# Altium project bga_fast.PrjPcb (part 1 of 2)
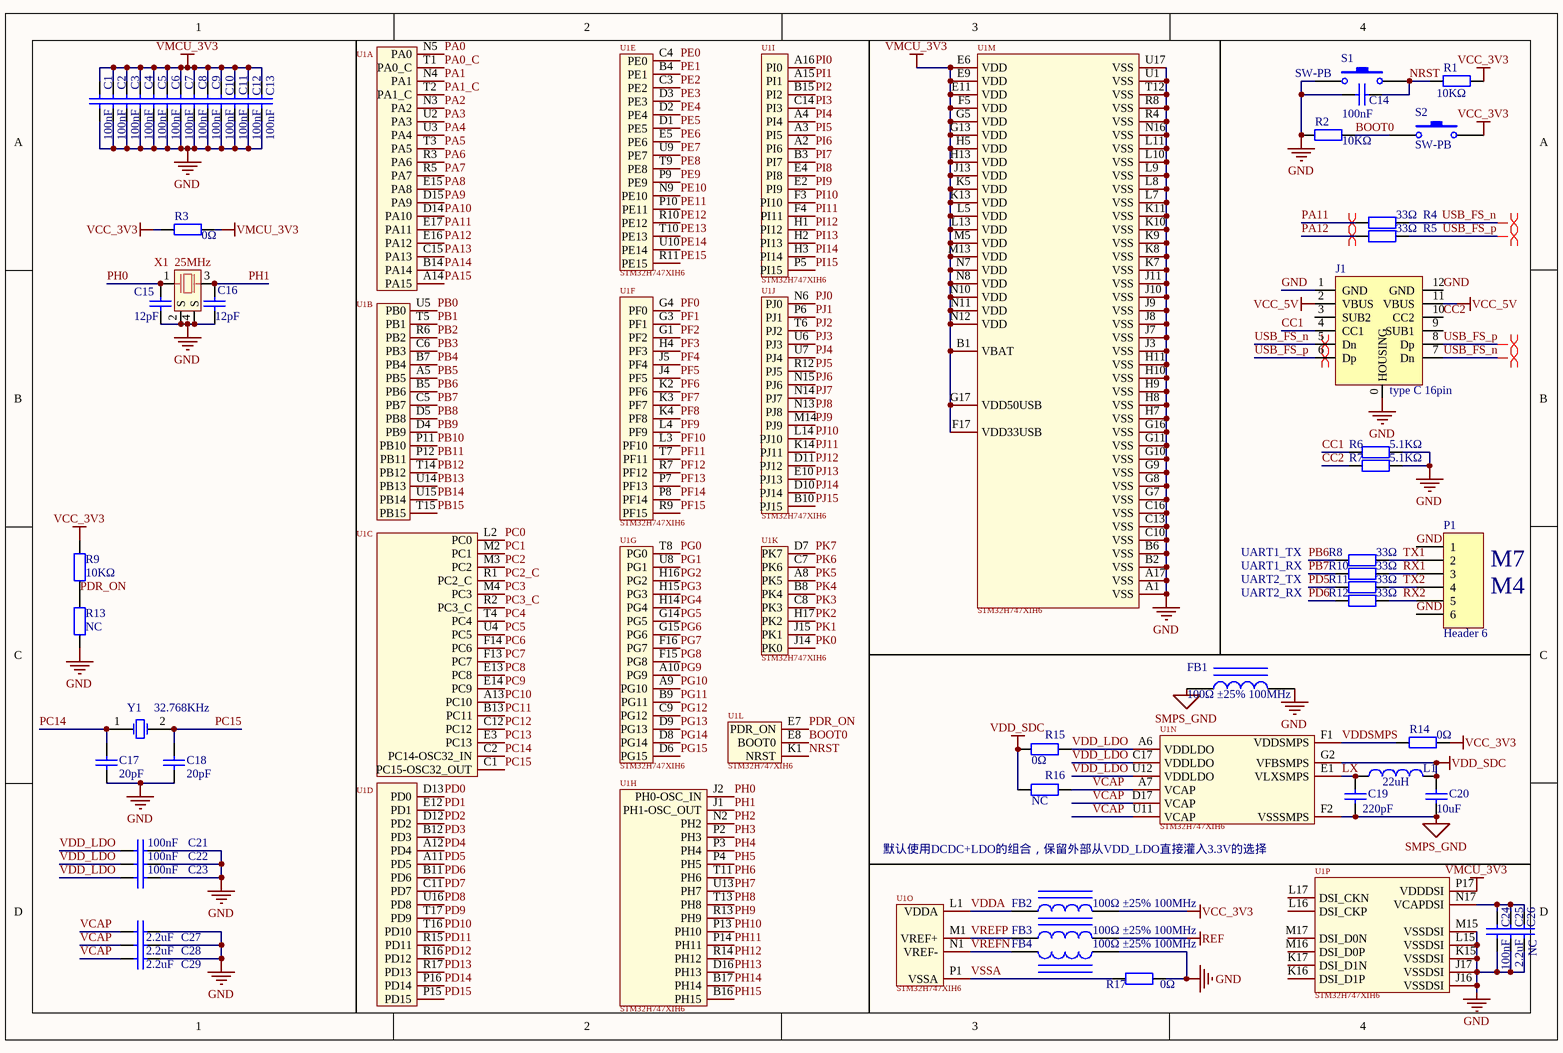
[diagram p0: mcu.SchDoc]
5 sheets, 288 parts. Net scope: global (net labels, ports and power ports of the same name join across sheets).
Board file: BGA_faser.PcbDoc
Sheets:
  mcu.SchDoc
  zynq.SchDoc
  jtag.SchDoc
  power.SchDoc
  debug.SchDoc

## Sheet mcu.SchDoc
size A4; SheetNumber: 1; SheetTotal: 4

### Parts
(Parts that share a designator on the sheet are numbered #1, #2 ... from top to bottom, then left to right.)
C1  100nF  [0201]
C2  100nF  [0201]
C3  100nF  [0201]
C4  100nF  [0201]
C5  100nF  [0201]
C6  100nF  [0201]
C7  100nF  [0201]
C8  100nF  [0201]
C9  100nF  [0201]
C10  100nF  [0201]
C11  100nF  [0201]
C12  100nF  [0201]
C13  100nF  [0201]
C14  100nF  [0402_C]
C15  12pF  [0402_C]
C16  12pF  [0402_C]
C17  20pF  [0402_C]
C18  20pF  [0402_C]
C19  220pF  [0402_C]
C20  10uF  [0603_C]
C21  100nF  [0402_C]
C22  100nF  [0402_C]
C23  100nF  [0402_C]
C24  100nF  [0402_C]
C25  2.2uF  [0402_C]
C26  NC  [0402_C]
C27  2.2uF  [0402_C]
C28  2.2uF  [0402_C]
C29  2.2uF  [0402_C]
FB1  100Ω ±25% 100MHz  [0805_L]
FB2  100Ω ±25% 100MHz  [0805_L]
FB3  100Ω ±25% 100MHz  [0805_L]
FB4  100Ω ±25% 100MHz  [0805_L]
J1  type C 16pin  [USB type C  16pin]
L1  value 22uH  [IND-SMD_L2.5-W2.0_YXMBL252010P]  (hidden comment: Inductor)
P1  Header 6  [HDR1X6]
R1  10KΩ  [0402_R]
R2  10KΩ  [0402_R]
R3  0Ω  [0402_R]
R4  33Ω  [0402_R]
R5  33Ω  [0402_R]
R6  5.1KΩ  [0402_R]
R7  5.1KΩ  [0402_R]
R8  33Ω  [0805_R]
R9  10KΩ  [0402_R]
R10  33Ω  [0805_R]
R11  33Ω  [0805_R]
R12  33Ω  [0805_R]
R13  NC  [0402_R]
R14  0Ω  [0402_R]
R15  0Ω  [0805_R]
R16  NC  [0805_R]
R17  0Ω  [0402_R]
S1  SW-PB  [SW-3*4-2P]
S2  SW-PB  [SW-3*4-2P]
U1#1  STM32H747XIH6  [TFBGA-265_L14.0-W14.0-P0.80-TL_STM32H743XIH6]  (value not drawn)  (parts A,B,C,D,E,F,G,H,I,J,K of 13)
U1#2  STM32H747XIH6  [TFBGA-265_L14.0-W14.0-P0.80-TL_STM32H743XIH6]  (parts L,M,N,O,P of 16)
X1  25MHz  [3225]
Y1  32.768KHz  [SMD-3215_2P FC - 135]

### Nets
GND: C1.1 C2.1 C3.1 C4.1 C5.1 C6.1 C7.1 C8.1 C9.1 C10.1 C11.1 C12.1 C13.1 C14.1 C15.2 C16.2 C17.1 C18.1 C21.2 C22.2 C23.2 C24.1 C25.1 C26.1 C27.2 C28.2 C29.2 FB1.2 FB4.2 J1.0(HOUSING) J1.1(GND) J1.12(GND) P1.1 P1.6 R2.1 R6.2 R7.2 R13.1 R17.1 S1.1 U1#2.A1(VSS) U1#2.A17(VSS) U1#2.B2(VSS) U1#2.B6(VSS) U1#2.C10(VSS) U1#2.C13(VSS) U1#2.C16(VSS) U1#2.G7(VSS) U1#2.G8(VSS) U1#2.G9(VSS) U1#2.G10(VSS) U1#2.G11(VSS) U1#2.G16(VSS) U1#2.H7(VSS) U1#2.H8(VSS) U1#2.H9(VSS) U1#2.H10(VSS) U1#2.H11(VSS) U1#2.J3(VSS) U1#2.J7(VSS) U1#2.J8(VSS) U1#2.J9(VSS) U1#2.J10(VSS) U1#2.J11(VSS) U1#2.J16(VSSDSI) U1#2.J17(VSSDSI) U1#2.K7(VSS) U1#2.K8(VSS) U1#2.K9(VSS) U1#2.K10(VSS) U1#2.K11(VSS) U1#2.K15(VSSDSI) U1#2.L7(VSS) U1#2.L8(VSS) U1#2.L9(VSS) U1#2.L10(VSS) U1#2.L11(VSS) U1#2.L15(VSSDSI) U1#2.M15(VSSDSI) U1#2.N16(VSS) U1#2.R4(VSS) U1#2.R8(VSS) U1#2.T12(VSS) U1#2.U1(VSS) U1#2.U17(VSS) X1.2(S) X1.4(S)
REF: FB3.2
SMPS_GND: C19.1 C20.1 FB1.1 U1#2.F2(VSSSMPS)
VCC_3V3: FB2.2 R1.2 R3.1 R9.2 R14.1 S2.2
VCC_5V: J1.2(VBUS) J1.11(VBUS)
VDD_SDC: C20.2 L1.2 R15.2 R16.2 U1#2.G2(VFBSMPS)
VMCU_3V3: C1.2 C2.2 C3.2 C4.2 C5.2 C6.2 C7.2 C8.2 C9.2 C10.2 C11.2 C12.2 C13.2 R3.2 U1#2.B1(VBAT) U1#2.E6(VDD) U1#2.E9(VDD) U1#2.E11(VDD) U1#2.F5(VDD) U1#2.F17(VDD33USB) U1#2.G5(VDD) U1#2.G13(VDD) U1#2.G17(VDD50USB) U1#2.H5(VDD) U1#2.H13(VDD) U1#2.J13(VDD) U1#2.K5(VDD) U1#2.K13(VDD) U1#2.L5(VDD) U1#2.L13(VDD) U1#2.M5(VDD) U1#2.M13(VDD) U1#2.N7(VDD) U1#2.N8(VDD) U1#2.N10(VDD) U1#2.N11(VDD) U1#2.N12(VDD) U1#2.P17(VDDDSI)
BOOT0: R2.2 S2.1 U1#2.E8(BOOT0)
CC1: J1.4(CC1) R6.1
CC2: J1.10(CC2) R7.1
LX: C19.2 L1.1 U1#2.E1(VLXSMPS)
NRST: C14.2 R1.1 S1.2 U1#2.K1(NRST)
PA0: U1#1.N5(PA0)
PA0_C: U1#1.T1(PA0_C)
PA1: U1#1.N4(PA1)
PA1_C: U1#1.T2(PA1_C)
PA2: U1#1.N3(PA2)
PA3: U1#1.U2(PA3)
PA4: U1#1.U3(PA4)
PA5: U1#1.T3(PA5)
PA6: U1#1.R3(PA6)
PA7: U1#1.R5(PA7)
PA8: U1#1.E15(PA8)
PA9: U1#1.D15(PA9)
PA10: U1#1.D14(PA10)
PA11: R4.1 U1#1.E17(PA11)
PA12: R5.1 U1#1.E16(PA12)
PA13: U1#1.C15(PA13)
PA14: U1#1.B14(PA14)
PA15: U1#1.A14(PA15)
PB0: U1#1.U5(PB0)
PB1: U1#1.T5(PB1)
PB2: U1#1.R6(PB2)
PB3: U1#1.C6(PB3)
PB4: U1#1.B7(PB4)
PB5: U1#1.A5(PB5)
PB6: R8.1 U1#1.B5(PB6)
PB7: R10.1 U1#1.C5(PB7)
PB8: U1#1.D5(PB8)
PB9: U1#1.D4(PB9)
PB10: U1#1.P11(PB10)
PB11: U1#1.P12(PB11)
PB12: U1#1.T14(PB12)
PB13: U1#1.U14(PB13)
PB14: U1#1.U15(PB14)
PB15: U1#1.T15(PB15)
PC0: U1#1.L2(PC0)
PC1: U1#1.M2(PC1)
PC2: U1#1.M3(PC2)
PC2_C: U1#1.R1(PC2_C)
PC3: U1#1.M4(PC3)
PC3_C: U1#1.R2(PC3_C)
PC4: U1#1.T4(PC4)
PC5: U1#1.U4(PC5)
PC6: U1#1.F14(PC6)
PC7: U1#1.F13(PC7)
PC8: U1#1.E13(PC8)
PC9: U1#1.E14(PC9)
PC10: U1#1.A13(PC10)
PC11: U1#1.B13(PC11)
PC12: U1#1.C12(PC12)
PC13: U1#1.E3(PC13)
PC14: C17.2 U1#1.C2(PC14-OSC32_IN) Y1.1(OSC1)
PC15: C18.2 U1#1.C1(PC15-OSC32_OUT) Y1.2(OSC2)
PD0: U1#1.D13(PD0)
PD1: U1#1.E12(PD1)
PD2: U1#1.D12(PD2)
PD3: U1#1.B12(PD3)
PD4: U1#1.A12(PD4)
PD5: R11.1 U1#1.A11(PD5)
PD6: R12.1 U1#1.B11(PD6)
PD7: U1#1.C11(PD7)
PD8: U1#1.U16(PD8)
PD9: U1#1.T17(PD9)
PD10: U1#1.T16(PD10)
PD11: U1#1.R15(PD11)
PD12: U1#1.R16(PD12)
PD13: U1#1.R17(PD13)
PD14: U1#1.P16(PD14)
PD15: U1#1.P15(PD15)
PDR_ON: R9.1 R13.2 U1#2.E7(PDR_ON)
PE0: U1#1.C4(PE0)
PE1: U1#1.B4(PE1)
PE2: U1#1.C3(PE2)
PE3: U1#1.D3(PE3)
PE4: U1#1.D2(PE4)
PE5: U1#1.D1(PE5)
PE6: U1#1.E5(PE6)
PE7: U1#1.U9(PE7)
PE8: U1#1.T9(PE8)
PE9: U1#1.P9(PE9)
PE10: U1#1.N9(PE10)
PE11: U1#1.P10(PE11)
PE12: U1#1.R10(PE12)
PE13: U1#1.T10(PE13)
PE14: U1#1.U10(PE14)
PE15: U1#1.R11(PE15)
PF0: U1#1.G4(PF0)
PF1: U1#1.G3(PF1)
PF2: U1#1.G1(PF2)
PF3: U1#1.H4(PF3)
PF4: U1#1.J5(PF4)
PF5: U1#1.J4(PF5)
PF6: U1#1.K2(PF6)
PF7: U1#1.K3(PF7)
PF8: U1#1.K4(PF8)
PF9: U1#1.L4(PF9)
PF10: U1#1.L3(PF10)
PF11: U1#1.T7(PF11)
PF12: U1#1.R7(PF12)
PF13: U1#1.P7(PF13)
PF14: U1#1.P8(PF14)
PF15: U1#1.R9(PF15)
PG0: U1#1.T8(PG0)
PG1: U1#1.U8(PG1)
PG2: U1#1.H16(PG2)
PG3: U1#1.H15(PG3)
PG4: U1#1.H14(PG4)
PG5: U1#1.G14(PG5)
PG6: U1#1.G15(PG6)
PG7: U1#1.F16(PG7)
PG8: U1#1.F15(PG8)
PG9: U1#1.A10(PG9)
PG10: U1#1.A9(PG10)
PG11: U1#1.B9(PG11)
PG12: U1#1.C9(PG12)
PG13: U1#1.D9(PG13)
PG14: U1#1.D8(PG14)
PG15: U1#1.D6(PG15)
PH0: C15.1 U1#1.J2(PH0-OSC_IN) X1.1
PH1: C16.1 U1#1.J1(PH1-OSC_OUT) X1.3
PH2: U1#1.N2(PH2)
PH3: U1#1.P2(PH3)
PH4: U1#1.P3(PH4)
PH5: U1#1.P4(PH5)
PH6: U1#1.T11(PH6)
PH7: U1#1.U13(PH7)
PH8: U1#1.T13(PH8)
PH9: U1#1.R13(PH9)
PH10: U1#1.P13(PH10)
PH11: U1#1.P14(PH11)
PH12: U1#1.R14(PH12)
PH13: U1#1.D16(PH13)
PH14: U1#1.B17(PH14)
PH15: U1#1.B16(PH15)
PI0: U1#1.A16(PI0)
PI1: U1#1.A15(PI1)
PI2: U1#1.B15(PI2)
PI3: U1#1.C14(PI3)
PI4: U1#1.A4(PI4)
PI5: U1#1.A3(PI5)
PI6: U1#1.A2(PI6)
PI7: U1#1.B3(PI7)
PI8: U1#1.E4(PI8)
PI9: U1#1.E2(PI9)
PI10: U1#1.F3(PI10)
PI11: U1#1.F4(PI11)
PI12: U1#1.H1(PI12)
PI13: U1#1.H2(PI13)
PI14: U1#1.H3(PI14)
PI15: U1#1.P5(PI15)
PJ0: U1#1.N6(PJ0)
PJ1: U1#1.P6(PJ1)
PJ2: U1#1.T6(PJ2)
PJ3: U1#1.U6(PJ3)
PJ4: U1#1.U7(PJ4)
PJ5: U1#1.R12(PJ5)
PJ6: U1#1.N15(PJ6)
PJ7: U1#1.N14(PJ7)
PJ8: U1#1.N13(PJ8)
PJ9: U1#1.M14(PJ9)
PJ10: U1#1.L14(PJ10)
PJ11: U1#1.K14(PJ11)
PJ12: U1#1.D11(PJ12)
PJ13: U1#1.E10(PJ13)
PJ14: U1#1.D10(PJ14)
PJ15: U1#1.B10(PJ15)
PK0: U1#1.J14(PK0)
PK1: U1#1.J15(PK1)
PK2: U1#1.H17(PK2)
PK3: U1#1.C8(PK3)
PK4: U1#1.B8(PK4)
PK5: U1#1.A8(PK5)
PK6: U1#1.C7(PK6)
PK7: U1#1.D7(PK7)
RX1: P1.3 R10.2
RX2: P1.5 R12.2
TX1: P1.2 R8.2
TX2: P1.4 R11.2
USB_FS_n: J1.5(Dn) J1.7(Dn) R4.2
USB_FS_p: J1.6(Dp) J1.8(Dp) R5.2
VCAP: C27.1 C28.1 C29.1 R16.1 U1#2.A7(VCAP) U1#2.D17(VCAP) U1#2.U11(VCAP)
VDD_LDO: C21.1 C22.1 C23.1 R15.1 U1#2.A6(VDDLDO) U1#2.C17(VDDLDO) U1#2.U12(VDDLDO)
VDDA: FB2.1 U1#2.L1(VDDA)
VDDSMPS: R14.2 U1#2.F1(VDDSMPS)
VREFN: FB4.1 U1#2.N1(VREF-)
VREFP: FB3.1 U1#2.M1(VREF+)
VSSA: R17.2 U1#2.P1(VSSA)
NetC24_2: C24.2 C25.2 C26.2 U1#2.N17(VCAPDSI)

Not connected (* = marked no-connect by the designer): J1 3(SUB2) 9(SUB1); U1#2 K16(DSI_D1P) K17(DSI_D1N) L16(DSI_CKP) L17(DSI_CKN) M16(DSI_D0P) M17(DSI_D0N)

### Layout directives
differential pair: PA11, PA12, USB_FS_n, USB_FS_p

### Notes on the sheet
- UART1_TX
- UART1_RX
- UART2_TX
- (near P1) M7
- UART2_RX
- (near P1) M4
- (near U1#2) 默认使用DCDC+LDO的组合，保留外部从VDD_LDO直接灌入3.3V的选择

### Library data of the parts
C1-C14 C21-C24 = 0402 100nF (104) 10% 16V: 贴片电容; ComponentLink1Description: 供应商链接; ComponentLink1URL: http://www.szlcsc.com/product/details_1877.html; Package: 0402; Supplier: LC; SuppliersPartNumber: C1525
C15-C18 = 0402 20pF (200) 5% 50V: 贴片电容; ComponentLink1Description: 供应商链接; ComponentLink1URL: http://www.szlcsc.com/product/details_1906.html; Package: 0402; Supplier: LC; SuppliersPartNumber: C1554
C19 = 0402 220pF (221) 10% 50V: 贴片电容; ComponentLink1Description: 供应商链接; ComponentLink1URL: http://www.szlcsc.com/product/details_1882.html; Package: 0402; Supplier: LC; SuppliersPartNumber: C1530
C20 = 0603 10uF (106) 10% 10V: 贴片电容; ComponentLink1Description: 供应商链接; ComponentLink1URL: http://www.szlcsc.com/product/details_20411.html; Package: 0603; Supplier: LC; SuppliersPartNumber: C19702
C25 C26 = 0402 2.2nF (222) 10% 50V: 贴片电容; ComponentLink1Description: 供应商链接; ComponentLink1URL: http://www.szlcsc.com/product/details_1883.html; Package: 0402; Supplier: LC; SuppliersPartNumber: C1531
C27-C29 = 0402 1.0uF (105) 10% 25V: 贴片电容; ComponentLink1Description: 供应商链接; ComponentLink1URL: http://www.szlcsc.com/product/details_53938.html; Package: 0402; Supplier: LC; SuppliersPartNumber: C52923
FB1-FB4 = 0805 100Ω 25% 100MHz: 贴片磁珠; ComponentLink1Description: 供应商链接; ComponentLink1URL: http://www.szlcsc.com/product/details_1367.html; Package: 0805; Supplier: LC; SuppliersPartNumber: C1015
J1 = USB type C 16pin: 16针脚C口
L1 = Inductor: Code_IEC: 1005; Published: 8-Jun-2000; LatestRevisionDate: 29-May-2009; LatestRevisionNote: IPC-7351 Footprint Added.; PackageReference: 0402-A; Publisher: Altium Limited; PackageDescription: Chip Inductor; Code_JEITA: 0402
P1 = Header 6: Header, 6-Pin; LatestRevisionDate: 17-Jul-2002; LatestRevisionNote: Re-released for DXP Platform.; Publisher: Altium Limited
R1 R2 R9 R13 = 0402 10KΩ (1002) 1%: 贴片电阻; ComponentLink1Description: 供应商链接; ComponentLink1URL: http://www.szlcsc.com/product/details_26487.html; Package: 0402; Supplier: LC; SuppliersPartNumber: C25744
R3 R14-R17 = 0402 0Ω (0R0) 1%: 贴片电阻; ComponentLink1Description: 供应商链接; ComponentLink1URL: http://www.szlcsc.com/product/details_17853.html; Package: 0402; Supplier: LC; SuppliersPartNumber: C17168
R4 R5 R8 R10-R12 = 0402 33Ω (33R0) 1%: 贴片电阻; ComponentLink1Description: 供应商链接; ComponentLink1URL: http://www.szlcsc.com/product/details_25848.html; Package: 0402; Supplier: LC; SuppliersPartNumber: C25105
R6 R7 = 0402 5.1KΩ (5101) 1%: 贴片电阻; ComponentLink1Description: 供应商链接; ComponentLink1URL: http://www.szlcsc.com/product/details_26648.html; Package: 0402; Supplier: LC; SuppliersPartNumber: C25905
S1 S2 = SW-PB: Switch; Published: 24-Mar-1999; LatestRevisionDate: 17-Jul-2002; LatestRevisionNote: Re-released for DXP Platform.; PackageReference: SPST-2; Publisher: Altium Limited; PackageDescription: Switch; 2 Leads
U1#1 U1#2 = STM32H747XIH6: 双核MCU; Manufacturer: ST(意法半导体); Add into BOM: yes; Symbol: STM32H747XIH6; Device: STM32H747XIH6; LCSC Part Name: 带DSP和DP-FPU的高性能ARM Cortex-M7 + Cortex-M4 MCU，具有2 MB Flash、1 MB RAM、480 MHz CPU、ART加速器、一级缓存、外部存储器接口、大量外设、SMPS和MIPI-DSI; Supplier Part: C5271089; Manufacturer Part: STM32H747XIH6; Supplier Footprint: TFBGA-265(14x14); JLCPCB Part Class: Extended Part; Datasheet: https://atta.szlcsc.com/upload/public/pdf/source/20230906/B22899485390F262A37AA3B845B2D1AE.pdf; Supplier: LCSC; Convert to PCB: yes
X1 = 四脚无源晶体: 4脚贴片无源晶体; Manufacturer: YJX(雅晶鑫); Symbol: TAXM8M4RDBCCT2T; Add into BOM: yes; Value: 8MHz; Normal temperature Frequency Tolerance: ±10ppm; Load Capacitance: 10pF; Frequency Stability: ±15ppm; Equivalent Series Resistance(ESR): 250Ω; Device: TAXM8M4RDBCCT2T; LCSC Part Name: 8MHz ±10ppm 10pF; Supplier Part: C400090; Manufacturer Part: TAXM8M4RDBCCT2T; Supplier Footprint: SMD3225-4P; JLCPCB Part Class: Extended Part; Datasheet: https://atta.szlcsc.com/upload/public/pdf/source/20190626/C400090_CF95B89E745AFE4EF2E392EF8AC009D6.pdf; Supplier: LCSC; Convert to PCB: yes; Type: 贴片晶振; Operating Temperature: -40℃~+85℃
Y1 = SMD-3215_2P 32.768KHz 20ppm 12.5pF: 贴片晶振; ComponentLink1Description: 供应商链接; ComponentLink1URL: http://www.szlcsc.com/product/details_33310.html; Package: SMD-3215_2P; Supplier: LC; SuppliersPartNumber: C32346

## Sheet zynq.SchDoc
size A3; SheetNumber: 2; SheetTotal: 5
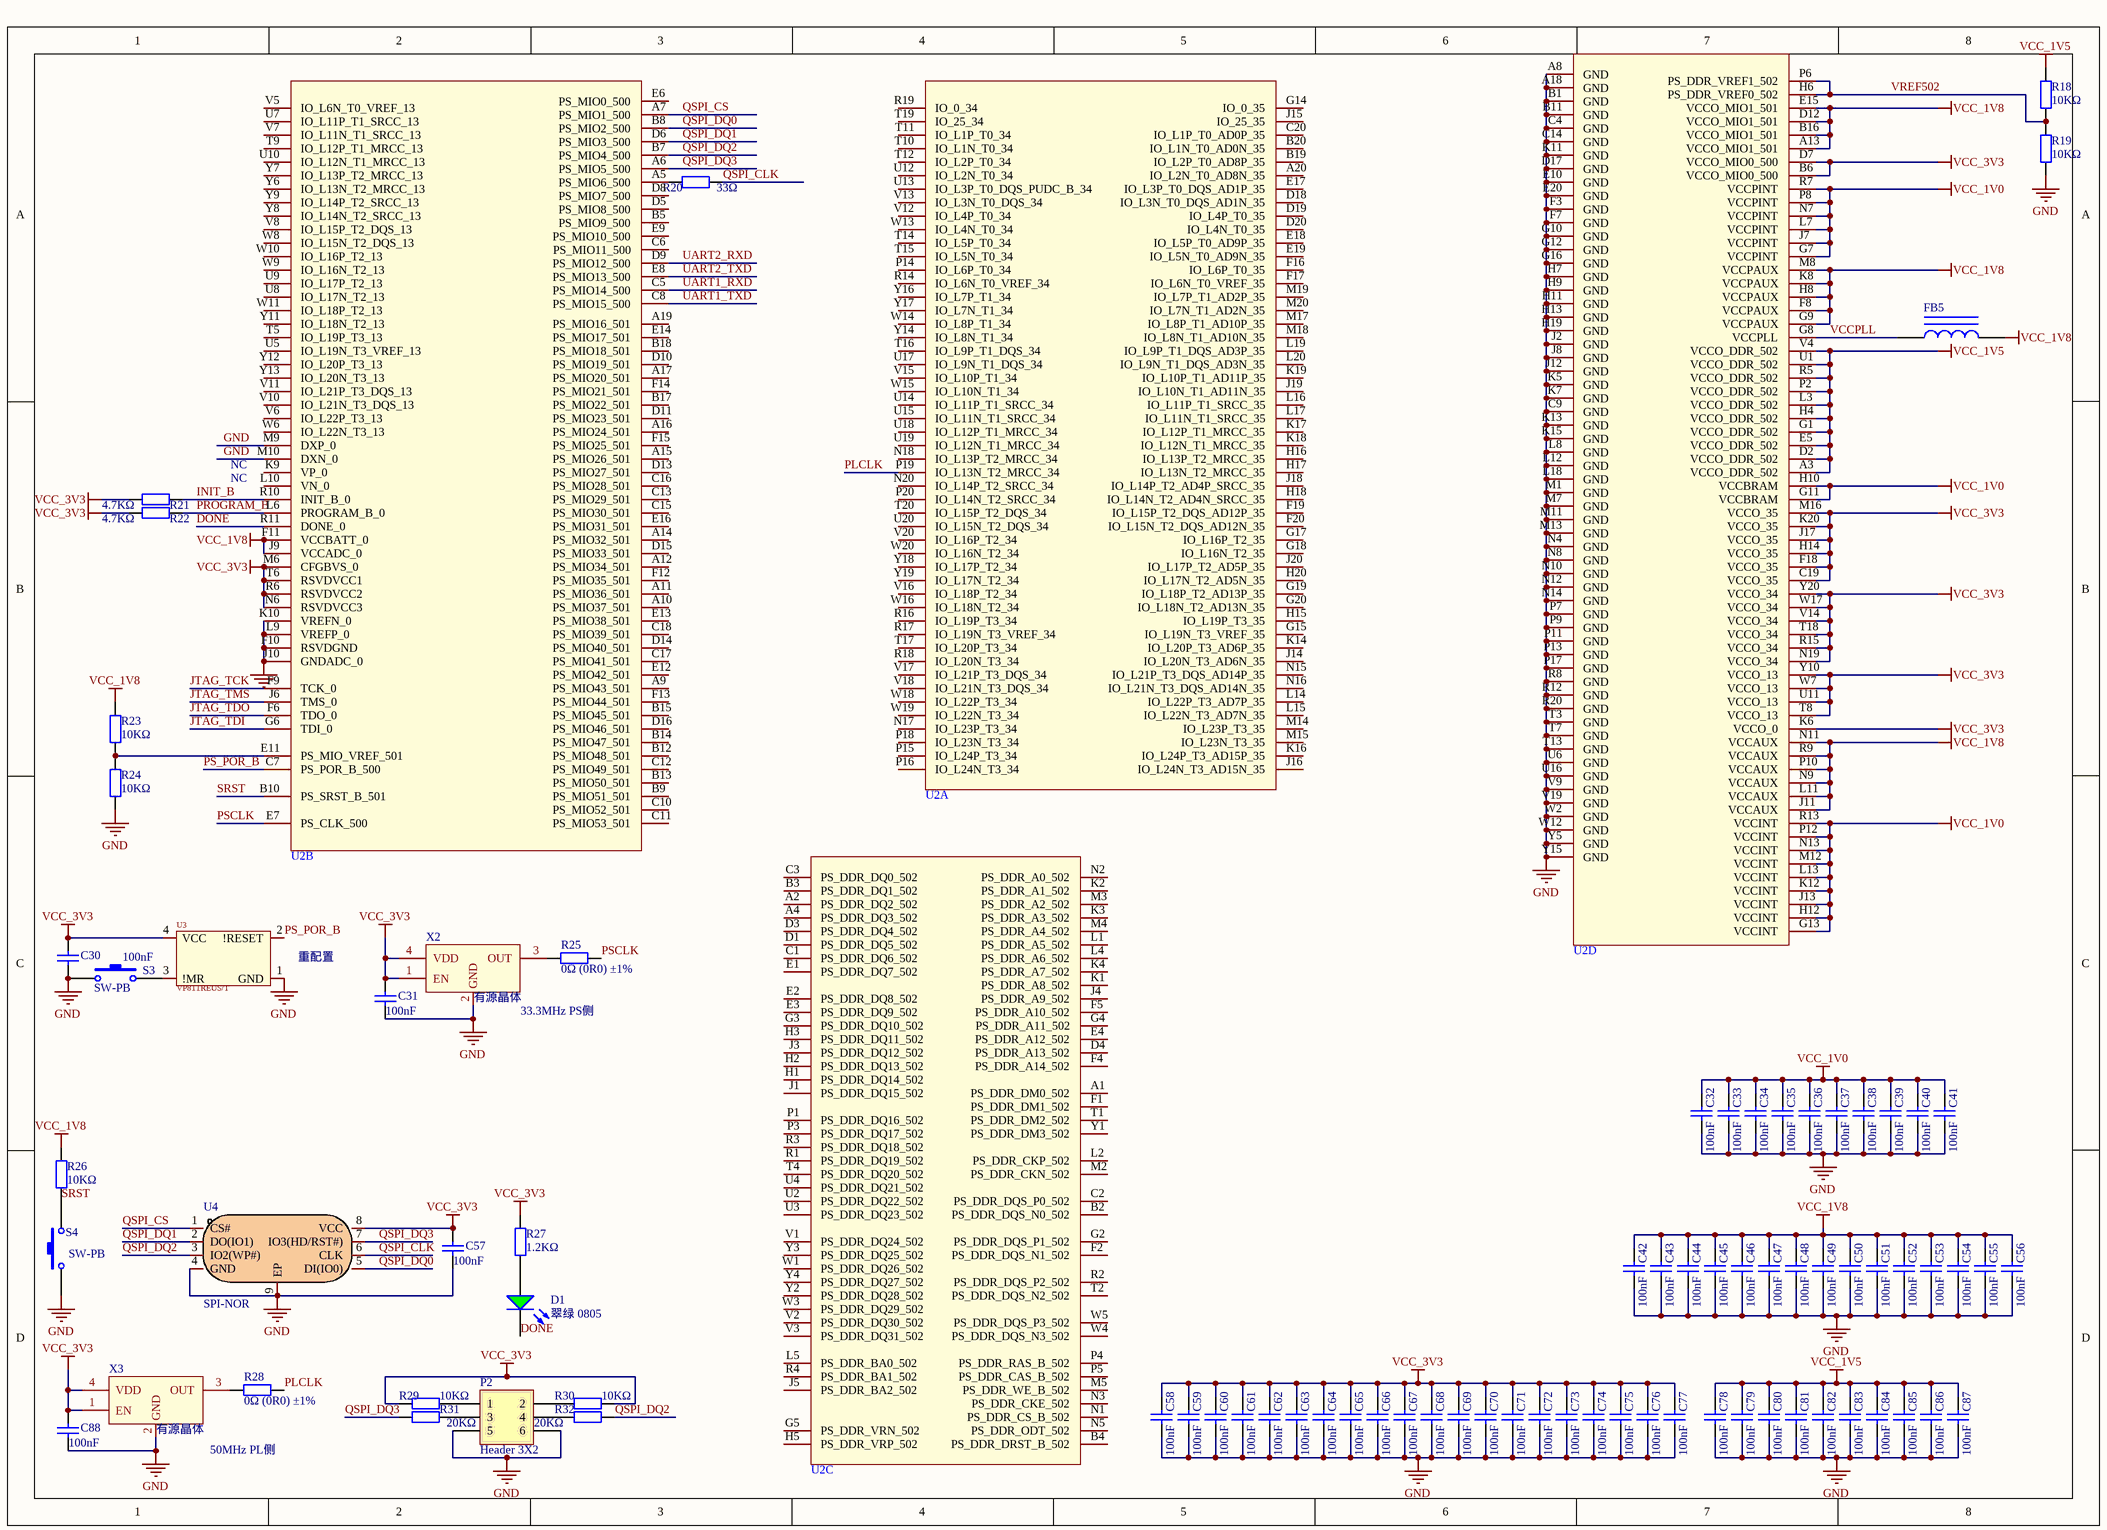
[diagram p1: zynq.SchDoc]

### Parts
C30  100nF  [0805_C]
C31  100nF  [0805_C]
C32  100nF  [0201]
C33  100nF  [0201]
C34  100nF  [0201]
C35  100nF  [0201]
C36  100nF  [0201]
C37  100nF  [0201]
C38  100nF  [0201]
C39  100nF  [0201]
C40  100nF  [0201]
C41  100nF  [0201]
C42  100nF  [0201]
C43  100nF  [0201]
C44  100nF  [0201]
C45  100nF  [0201]
C46  100nF  [0201]
C47  100nF  [0201]
C48  100nF  [0201]
C49  100nF  [0201]
C50  100nF  [0201]
C51  100nF  [0201]
C52  100nF  [0201]
C53  100nF  [0201]
C54  100nF  [0201]
C55  100nF  [0201]
C56  100nF  [0201]
C57  100nF  [0402_C]
C58  100nF  [0201]
C59  100nF  [0201]
C60  100nF  [0201]
C61  100nF  [0201]
C62  100nF  [0201]
C63  100nF  [0201]
C64  100nF  [0201]
C65  100nF  [0201]
C66  100nF  [0201]
C67  100nF  [0201]
C68  100nF  [0201]
C69  100nF  [0201]
C70  100nF  [0201]
C71  100nF  [0201]
C72  100nF  [0201]
C73  100nF  [0201]
C74  100nF  [0201]
C75  100nF  [0201]
C76  100nF  [0201]
C77  100nF  [0201]
C78  100nF  [0201]
C79  100nF  [0201]
C80  100nF  [0201]
C81  100nF  [0201]
C82  100nF  [0201]
C83  100nF  [0201]
C84  100nF  [0201]
C85  100nF  [0201]
C86  100nF  [0201]
C87  100nF  [0201]
C88  100nF  [0805_C]
D1  翠绿 0805  [0805_LED_S1]
FB5  100Ω ±25% 100MHz  [0805_L]  (value not drawn)
P2  Header 3X2  [HDR2X3]
R18  10KΩ  [0805_R]
R19  10KΩ  [0805_R]
R20  33Ω  [0402_R]
R21  4.7KΩ  [0805_R]
R22  4.7KΩ  [0805_R]
R23  10KΩ  [0805_R]
R24  10KΩ  [0805_R]
R25  0Ω (0R0) ±1%  [0805_R]
R26  10KΩ  [0805_R]
R27  1.2KΩ  [0805_R]
R28  0Ω (0R0) ±1%  [0805_R]
R29  10KΩ  [0402_R]
R30  10KΩ  [0402_R]
R31  20KΩ  [0402_R]
R32  20KΩ  [0402_R]
S3  SW-PB  [SW-3*4-2P]
S4  SW-PB  [SW-3*4-2P]
U2  XC7Z020-2CLG400I  [FBGA-400_L17.0-W17.0-R20-C20-P0.80-TL]  (value not drawn)  (parts A,B,C,D of 4)
U3  VP811REUS/T  [SOT-143_L2.9-W1.3-P1.92-LS2.3-BL]
U4  SPI-NOR  [WSON8]
X2  有源晶体  [3225]
X3  有源晶体  [3225]

### Nets
GND: C30.1 C31.1 C32.1 C33.1 C34.1 C35.1 C36.1 C37.1 C38.1 C39.1 C40.1 C41.1 C42.1 C43.1 C44.1 C45.1 C46.1 C47.1 C48.1 C49.1 C50.1 C51.1 C52.1 C53.1 C54.1 C55.1 C56.1 C57.1 C58.1 C59.1 C60.1 C61.1 C62.1 C63.1 C64.1 C65.1 C66.1 C67.1 C68.1 C69.1 C70.1 C71.1 C72.1 C73.1 C74.1 C75.1 C76.1 C77.1 C78.1 C79.1 C80.1 C81.1 C82.1 C83.1 C84.1 C85.1 C86.1 C87.1 C88.1 P2.5 P2.6 R19.1 R24.1 S3.1 S4.1 U2.A8(GND) U2.A18(GND) U2.B1(GND) U2.B11(GND) U2.C4(GND) U2.C9(GND) U2.C14(GND) U2.D17(GND) U2.E10(GND) U2.E20(GND) U2.F3(GND) U2.F7(GND) U2.F10(RSVDGND) U2.G10(GND) U2.G12(GND) U2.G16(GND) U2.H7(GND) U2.H9(GND) U2.H11(GND) U2.H13(GND) U2.H19(GND) U2.J2(GND) U2.J8(GND) U2.J10(GNDADC_0) U2.J12(GND) U2.K5(GND) U2.K7(GND) U2.K10(VREFN_0) U2.K11(GND) U2.K13(GND) U2.K15(GND) U2.L8(GND) U2.L9(VREFP_0) U2.L12(GND) U2.L18(GND) U2.M1(GND) U2.M7(GND) U2.M9(DXP_0) U2.M10(DXN_0) U2.M11(GND) U2.M13(GND) U2.N4(GND) U2.N8(GND) U2.N10(GND) U2.N12(GND) U2.N14(GND) U2.P7(GND) U2.P9(GND) U2.P11(GND) U2.P13(GND) U2.P17(GND) U2.R8(GND) U2.R12(GND) U2.R20(GND) U2.T3(GND) U2.T7(GND) U2.T13(GND) U2.U6(GND) U2.U16(GND) U2.V9(GND) U2.V19(GND) U2.W2(GND) U2.W12(GND) U2.Y5(GND) U2.Y15(GND) U3.1(GND) U4.4(GND) U4.9(EP) X2.2(GND) X3.2(GND)
VCC_1V0: C32.2 C33.2 C34.2 C35.2 C36.2 C37.2 C38.2 C39.2 C40.2 C41.2 U2.G7(VCCPINT) U2.G11(VCCBRAM) U2.G13(VCCINT) U2.H10(VCCBRAM) U2.H12(VCCINT) U2.J7(VCCPINT) U2.J13(VCCINT) U2.K12(VCCINT) U2.L7(VCCPINT) U2.L13(VCCINT) U2.M12(VCCINT) U2.N7(VCCPINT) U2.N13(VCCINT) U2.P8(VCCPINT) U2.P12(VCCINT) U2.R7(VCCPINT) U2.R13(VCCINT)
VCC_1V5: C78.2 C79.2 C80.2 C81.2 C82.2 C83.2 C84.2 C85.2 C86.2 C87.2 R18.2 U2.A3(VCCO_DDR_502) U2.D2(VCCO_DDR_502) U2.E5(VCCO_DDR_502) U2.G1(VCCO_DDR_502) U2.H4(VCCO_DDR_502) U2.L3(VCCO_DDR_502) U2.P2(VCCO_DDR_502) U2.R5(VCCO_DDR_502) U2.U1(VCCO_DDR_502) U2.V4(VCCO_DDR_502)
VCC_1V8: C42.2 C43.2 C44.2 C45.2 C46.2 C47.2 C48.2 C49.2 C50.2 C51.2 C52.2 C53.2 C54.2 C55.2 C56.2 FB5.2 R23.2 R26.2 U2.A13(VCCO_MIO1_501) U2.B16(VCCO_MIO1_501) U2.D12(VCCO_MIO1_501) U2.E15(VCCO_MIO1_501) U2.F8(VCCPAUX) U2.F11(VCCBATT_0) U2.G9(VCCPAUX) U2.H8(VCCPAUX) U2.J9(VCCADC_0) U2.J11(VCCAUX) U2.K8(VCCPAUX) U2.L11(VCCAUX) U2.M8(VCCPAUX) U2.N9(VCCAUX) U2.N11(VCCAUX) U2.P10(VCCAUX) U2.R9(VCCAUX)
VCC_3V3: C30.2 C31.2 C57.2 C58.2 C59.2 C60.2 C61.2 C62.2 C63.2 C64.2 C65.2 C66.2 C67.2 C68.2 C69.2 C70.2 C71.2 C72.2 C73.2 C74.2 C75.2 C76.2 C77.2 C88.2 R21.1 R22.1 R27.2 R29.1 R30.2 U2.B6(VCCO_MIO0_500) U2.C19(VCCO_35) U2.D7(VCCO_MIO0_500) U2.F18(VCCO_35) U2.H14(VCCO_35) U2.J17(VCCO_35) U2.K6(VCCO_0) U2.K20(VCCO_35) U2.M6(CFGBVS_0) U2.M16(VCCO_35) U2.N6(RSVDVCC3) U2.N19(VCCO_34) U2.R6(RSVDVCC2) U2.R15(VCCO_34) U2.T6(RSVDVCC1) U2.T8(VCCO_13) U2.T18(VCCO_34) U2.U11(VCCO_13) U2.V14(VCCO_34) U2.W7(VCCO_13) U2.W17(VCCO_34) U2.Y10(VCCO_13) U2.Y20(VCCO_34) U3.4(VCC) U4.8(VCC) X2.1(EN) X2.4(VDD) X3.1(EN) X3.4(VDD)
DONE: D1.K U2.R11(DONE_0)
INIT_B: R21.2 U2.R10(INIT_B_0)
JTAG_TCK: U2.F9(TCK_0)
JTAG_TDI: U2.G6(TDI_0)
JTAG_TDO: U2.F6(TDO_0)
JTAG_TMS: U2.J6(TMS_0)
PLCLK: R28.2 U2.P19(IO_L13N_T2_MRCC_34)
PROGRAM_B: R22.2 U2.L6(PROGRAM_B_0)
PS_POR_B: U2.C7(PS_POR_B_500) U3.2(!RESET)
PSCLK: R25.2 U2.E7(PS_CLK_500)
QSPI_CLK: R20.2 U4.6(CLK)
QSPI_CS: U2.A7(PS_MIO1_500) U4.1(CS#)
QSPI_DQ0: U2.B8(PS_MIO2_500) U4.5(DI(IO0))
QSPI_DQ1: U2.D6(PS_MIO3_500) U4.2(DO(IO1))
QSPI_DQ2: R32.2 U2.B7(PS_MIO4_500) U4.3(IO2(WP#))
QSPI_DQ3: R31.1 U2.A6(PS_MIO5_500) U4.7(IO3(HD/RST#))
SRST: R26.1 S4.2 U2.B10(PS_SRST_B_501)
UART1_RXD: U2.C5(PS_MIO14_500)
UART1_TXD: U2.C8(PS_MIO15_500)
UART2_RXD: U2.D9(PS_MIO12_500)
UART2_TXD: U2.E8(PS_MIO13_500)
VCCPLL: FB5.1 U2.G8(VCCPLL)
VREF502: R18.1 R19.2 U2.H6(PS_DDR_VREF0_502) U2.P6(PS_DDR_VREF1_502)
NetD1_A: D1.A R27.1
NetP2_1: P2.1 R29.2
NetP2_2: P2.2 R30.1
NetP2_3: P2.3 R31.2
NetP2_4: P2.4 R32.1
NetR20_1: R20.1 U2.A5(PS_MIO6_500)
NetR23_1: R23.1 R24.2 U2.E11(PS_MIO_VREF_501)
NetR25_1: R25.1 X2.3(OUT)
NetR28_1: R28.1 X3.3(OUT)
NetS3_2: S3.2 U3.3(!MR)

Not connected (* = marked no-connect by the designer): U2 A1(PS_DDR_DM0_502) A2(PS_DDR_DQ2_502) A4(PS_DDR_DQ3_502) A9(PS_MIO43_501) A10(PS_MIO37_501) A11(PS_MIO36_501) A12(PS_MIO34_501) A14(PS_MIO32_501) A15(PS_MIO26_501) A16(PS_MIO24_501) A17(PS_MIO20_501) A19(PS_MIO16_501) A20(IO_L2N_T0_AD8N_35) B2(PS_DDR_DQS_N0_502) B3(PS_DDR_DQ1_502) B4(PS_DDR_DRST_B_502) B5(PS_MIO9_500) B9(PS_MIO51_501) B12(PS_MIO48_501) B13(PS_MIO50_501) B14(PS_MIO47_501) B15(PS_MIO45_501) B17(PS_MIO22_501) B18(PS_MIO18_501) B19(IO_L2P_T0_AD8P_35) B20(IO_L1N_T0_AD0N_35) C1(PS_DDR_DQ6_502) C2(PS_DDR_DQS_P0_502) C3(PS_DDR_DQ0_502) C6(PS_MIO11_500) C10(PS_MIO52_501) C11(PS_MIO53_501) C12(PS_MIO49_501) C13(PS_MIO29_501) C15(PS_MIO30_501) C16(PS_MIO28_501) C17(PS_MIO41_501) C18(PS_MIO39_501) C20(IO_L1P_T0_AD0P_35) D1(PS_DDR_DQ5_502) D3(PS_DDR_DQ4_502) D4(PS_DDR_A13_502) D5(PS_MIO8_500) D8(PS_MIO7_500) D10(PS_MIO19_501) D11(PS_MIO23_501) D13(PS_MIO27_501) D14(PS_MIO40_501) D15(PS_MIO33_501) D16(PS_MIO46_501) D18(IO_L3N_T0_DQS_AD1N_35) D19(IO_L4P_T0_35) D20(IO_L4N_T0_35) E1(PS_DDR_DQ7_502) E2(PS_DDR_DQ8_502) E3(PS_DDR_DQ9_502) E4(PS_DDR_A12_502) E6(PS_MIO0_500) E9(PS_MIO10_500) E12(PS_MIO42_501) E13(PS_MIO38_501) E14(PS_MIO17_501) E16(PS_MIO31_501) E17(IO_L3P_T0_DQS_AD1P_35) E18(IO_L5P_T0_AD9P_35) E19(IO_L5N_T0_AD9N_35) F1(PS_DDR_DM1_502) F2(PS_DDR_DQS_N1_502) F4(PS_DDR_A14_502) F5(PS_DDR_A10_502) F12(PS_MIO35_501) F13(PS_MIO44_501) F14(PS_MIO21_501) F15(PS_MIO25_501) F16(IO_L6P_T0_35) F17(IO_L6N_T0_VREF_35) F19(IO_L15P_T2_DQS_AD12P_35) F20(IO_L15N_T2_DQS_AD12N_35) G2(PS_DDR_DQS_P1_502) G3(PS_DDR_DQ10_502) G4(PS_DDR_A11_502) G5(PS_DDR_VRN_502) G14(IO_0_35) G15(IO_L19N_T3_VREF_35) G17(IO_L16P_T2_35) G18(IO_L16N_T2_35) G19(IO_L18P_T2_AD13P_35) G20(IO_L18N_T2_AD13N_35) H1(PS_DDR_DQ14_502) H2(PS_DDR_DQ13_502) H3(PS_DDR_DQ11_502) H5(PS_DDR_VRP_502) H15(IO_L19P_T3_35) H16(IO_L13P_T2_MRCC_35) H17(IO_L13N_T2_MRCC_35) H18(IO_L14N_T2_AD4N_SRCC_35) H20(IO_L17N_T2_AD5N_35) J1(PS_DDR_DQ15_502) J3(PS_DDR_DQ12_502) J4(PS_DDR_A9_502) J5(PS_DDR_BA2_502) J14(IO_L20N_T3_AD6N_35) J15(IO_25_35) J16(IO_L24N_T3_AD15N_35) J18(IO_L14P_T2_AD4P_SRCC_35) J19(IO_L10N_T1_AD11N_35) J20(IO_L17P_T2_AD5P_35) K1(PS_DDR_A8_502) K2(PS_DDR_A1_502) K3(PS_DDR_A3_502) K4(PS_DDR_A7_502) K9(VP_0) K14(IO_L20P_T3_AD6P_35) K16(IO_L24P_T3_AD15P_35) K17(IO_L12P_T1_MRCC_35) K18(IO_L12N_T1_MRCC_35) K19(IO_L10P_T1_AD11P_35) L1(PS_DDR_A5_502) L2(PS_DDR_CKP_502) L4(PS_DDR_A6_502) L5(PS_DDR_BA0_502) L10(VN_0) L14(IO_L22P_T3_AD7P_35) L15(IO_L22N_T3_AD7N_35) L16(IO_L11P_T1_SRCC_35) L17(IO_L11N_T1_SRCC_35) L19(IO_L9P_T1_DQS_AD3P_35) L20(IO_L9N_T1_DQS_AD3N_35) M2(PS_DDR_CKN_502) M3(PS_DDR_A2_502) M4(PS_DDR_A4_502) M5(PS_DDR_WE_B_502) M14(IO_L23P_T3_35) M15(IO_L23N_T3_35) M17(IO_L8P_T1_AD10P_35) M18(IO_L8N_T1_AD10N_35) M19(IO_L7P_T1_AD2P_35) M20(IO_L7N_T1_AD2N_35) N1(PS_DDR_CS_B_502) N2(PS_DDR_A0_502) N3(PS_DDR_CKE_502) N5(PS_DDR_ODT_502) N15(IO_L21P_T3_DQS_AD14P_35) N16(IO_L21N_T3_DQS_AD14N_35) N17(IO_L23P_T3_34) N18(IO_L13P_T2_MRCC_34) N20(IO_L14P_T2_SRCC_34) P1(PS_DDR_DQ16_502) P3(PS_DDR_DQ17_502) P4(PS_DDR_RAS_B_502) P5(PS_DDR_CAS_B_502) P14(IO_L6P_T0_34) P15(IO_L24P_T3_34) P16(IO_L24N_T3_34) P18(IO_L23N_T3_34) P20(IO_L14N_T2_SRCC_34) R1(PS_DDR_DQ19_502) R2(PS_DDR_DQS_P2_502) R3(PS_DDR_DQ18_502) R4(PS_DDR_BA1_502) R14(IO_L6N_T0_VREF_34) R16(IO_L19P_T3_34) R17(IO_L19N_T3_VREF_34) R18(IO_L20N_T3_34) R19(IO_0_34) T1(PS_DDR_DM2_502) T2(PS_DDR_DQS_N2_502) T4(PS_DDR_DQ20_502) T5(IO_L19P_T3_13) T9(IO_L12P_T1_MRCC_13) T10(IO_L1N_T0_34) T11(IO_L1P_T0_34) T12(IO_L2P_T0_34) T14(IO_L5P_T0_34) T15(IO_L5N_T0_34) T16(IO_L9P_T1_DQS_34) T17(IO_L20P_T3_34) T19(IO_25_34) T20(IO_L15P_T2_DQS_34) U2(PS_DDR_DQ22_502) U3(PS_DDR_DQ23_502) U4(PS_DDR_DQ21_502) U5(IO_L19N_T3_VREF_13) U7(IO_L11P_T1_SRCC_13) U8(IO_L17N_T2_13) U9(IO_L17P_T2_13) U10(IO_L12N_T1_MRCC_13) U12(IO_L2N_T0_34) U13(IO_L3P_T0_DQS_PUDC_B_34) U14(IO_L11P_T1_SRCC_34) U15(IO_L11N_T1_SRCC_34) U17(IO_L9N_T1_DQS_34) U18(IO_L12P_T1_MRCC_34) U19(IO_L12N_T1_MRCC_34) U20(IO_L15N_T2_DQS_34) V1(PS_DDR_DQ24_502) V2(PS_DDR_DQ30_502) V3(PS_DDR_DQ31_502) V5(IO_L6N_T0_VREF_13) V6(IO_L22P_T3_13) V7(IO_L11N_T1_SRCC_13) V8(IO_L15P_T2_DQS_13) V10(IO_L21N_T3_DQS_13) V11(IO_L21P_T3_DQS_13) V12(IO_L4P_T0_34) V13(IO_L3N_T0_DQS_34) V15(IO_L10P_T1_34) V16(IO_L18P_T2_34) V17(IO_L21P_T3_DQS_34) V18(IO_L21N_T3_DQS_34) V20(IO_L16P_T2_34) W1(PS_DDR_DQ26_502) W3(PS_DDR_DQ29_502) W4(PS_DDR_DQS_N3_502) W5(PS_DDR_DQS_P3_502) W6(IO_L22N_T3_13) W8(IO_L15N_T2_DQS_13) W9(IO_L16N_T2_13) W10(IO_L16P_T2_13) W11(IO_L18P_T2_13) W13(IO_L4N_T0_34) W14(IO_L8P_T1_34) W15(IO_L10N_T1_34) W16(IO_L18N_T2_34) W18(IO_L22P_T3_34) W19(IO_L22N_T3_34) W20(IO_L16N_T2_34) Y1(PS_DDR_DM3_502) Y2(PS_DDR_DQ28_502) Y3(PS_DDR_DQ25_502) Y4(PS_DDR_DQ27_502) Y6(IO_L13N_T2_MRCC_13) Y7(IO_L13P_T2_MRCC_13) Y8(IO_L14N_T2_SRCC_13) Y9(IO_L14P_T2_SRCC_13) Y11(IO_L18N_T2_13) Y12(IO_L20P_T3_13) Y13(IO_L20N_T3_13) Y14(IO_L8N_T1_34) Y16(IO_L7P_T1_34) Y17(IO_L7N_T1_34) Y18(IO_L17P_T2_34) Y19(IO_L17N_T2_34)

### Notes on the sheet
- NC
- (near U3) 重配置
- (near X2) 33.3MHz PS侧
- (near X3) 50MHz PL侧

### Library data of the parts
C30-C88 = 0402 100nF (104) 10% 16V: 贴片电容; ComponentLink1Description: 供应商链接; ComponentLink1URL: http://www.szlcsc.com/product/details_1877.html; Package: 0402; Supplier: LC; SuppliersPartNumber: C1525
D1 = 0805 翠绿: 发光二极管; ComponentLink1Description: 供应商链接; ComponentLink1URL: http://www.szlcsc.com/product/details_2670.html; Package: 0805; Supplier: LC; SuppliersPartNumber: C2297
FB5 = 0805 100Ω 25% 100MHz: 贴片磁珠; ComponentLink1Description: 供应商链接; ComponentLink1URL: http://www.szlcsc.com/product/details_1367.html; Package: 0805; Supplier: LC; SuppliersPartNumber: C1015
P2 = Header 3X2: Header, 3-Pin, Dual row; LatestRevisionDate: 17-Jul-2002; LatestRevisionNote: Re-released for DXP Platform.; Publisher: Altium Limited
R18 R19 R23 R24 = 0805 10KΩ (1002) 1%: 贴片电阻; ComponentLink1Description: 供应商链接; ComponentLink1URL: http://www.szlcsc.com/product/details_18102.html; Package: 0805; Supplier: LC; SuppliersPartNumber: C17414
R20 = 0402 33Ω (33R0) 1%: 贴片电阻; ComponentLink1Description: 供应商链接; ComponentLink1URL: http://www.szlcsc.com/product/details_25848.html; Package: 0402; Supplier: LC; SuppliersPartNumber: C25105
R21 R22 = 0402 4.7KΩ (4701) 1%: 贴片电阻; ComponentLink1Description: 供应商链接; ComponentLink1URL: http://www.szlcsc.com/product/details_26643.html; Package: 0402; Supplier: LC; SuppliersPartNumber: C25900
R25 R28 = 0805 0Ω (0R0) 1%: 贴片电阻; ComponentLink1Description: 供应商链接; ComponentLink1URL: http://www.szlcsc.com/product/details_18165.html; Package: 0805; Supplier: LC; SuppliersPartNumber: C17477
R26 R29 R30 = 0402 10KΩ (1002) 1%: 贴片电阻; ComponentLink1Description: 供应商链接; ComponentLink1URL: http://www.szlcsc.com/product/details_26487.html; Package: 0402; Supplier: LC; SuppliersPartNumber: C25744
R27 = 0805 1.2KΩ (1201) 1%: 贴片电阻; ComponentLink1Description: 供应商链接; ComponentLink1URL: http://www.szlcsc.com/product/details_18067.html; Package: 0805; Supplier: LC; SuppliersPartNumber: C17379
R31 R32 = 0402 20KΩ (2002) 1%: 贴片电阻; ComponentLink1Description: 供应商链接; ComponentLink1URL: http://www.szlcsc.com/product/details_26508.html; Package: 0402; Supplier: LC; SuppliersPartNumber: C25765
S3 S4 = SW-PB: Switch; Published: 24-Mar-1999; LatestRevisionDate: 17-Jul-2002; LatestRevisionNote: Re-released for DXP Platform.; PackageReference: SPST-2; Publisher: Altium Limited; PackageDescription: Switch; 2 Leads
U2 = XC7Z020-2CLG400I: Manufacturer: XILINX(赛灵思); Convert to PCB: yes; Symbol: XC7Z020-2CLG400I; Device: XC7Z020-2CLG400I; Add into BOM: yes; Supplier: LCSC; Supplier Part: C569043; Supplier Footprint: CSPBGA-400; JLCPCB Part Class: 扩展库; LCSC Part Name: -; Datasheet: https://atta.szlcsc.com/upload/public/pdf/source/20191108/C446028_7ED8319F1F88212BA1E5D387DA4ECDB9.pdf; Manufacturer Part: XC7Z020-2CLG400I
U3 = VP811REUS/T: 复位电平管理芯片; Manufacturer: VP(中芯集成); Add into BOM: yes; ChipType: 电源监控器; Output Type: 开漏; Reset Active Level: 低电平有效; Number of Voltages Monitored: 1; Manual Reset: 有; Watchdog: 无; Symbol: VP811REUS/T; Device: VP811REUS/T; LCSC Part Name: VP811REUS/T; Supplier Part: C381485; Manufacturer Part: VP811REUS/T; Supplier Footprint: SOT-143; JLCPCB Part Class: Extended Part; Datasheet: https://atta.szlcsc.com/upload/public/pdf/source/20190322/C381486_AD49D5EAA1071F589CB38927003B9E48.pdf; Supplier: LCSC; Convert to PCB: yes; Operating Temperature: -40℃~+125℃@(Tj)
U4 = W25Q64: NOR FLASH
X2 X3 = 有源晶体: 有源晶振

## Sheet jtag.SchDoc
size A4; SheetNumber: 3; SheetTotal: 5
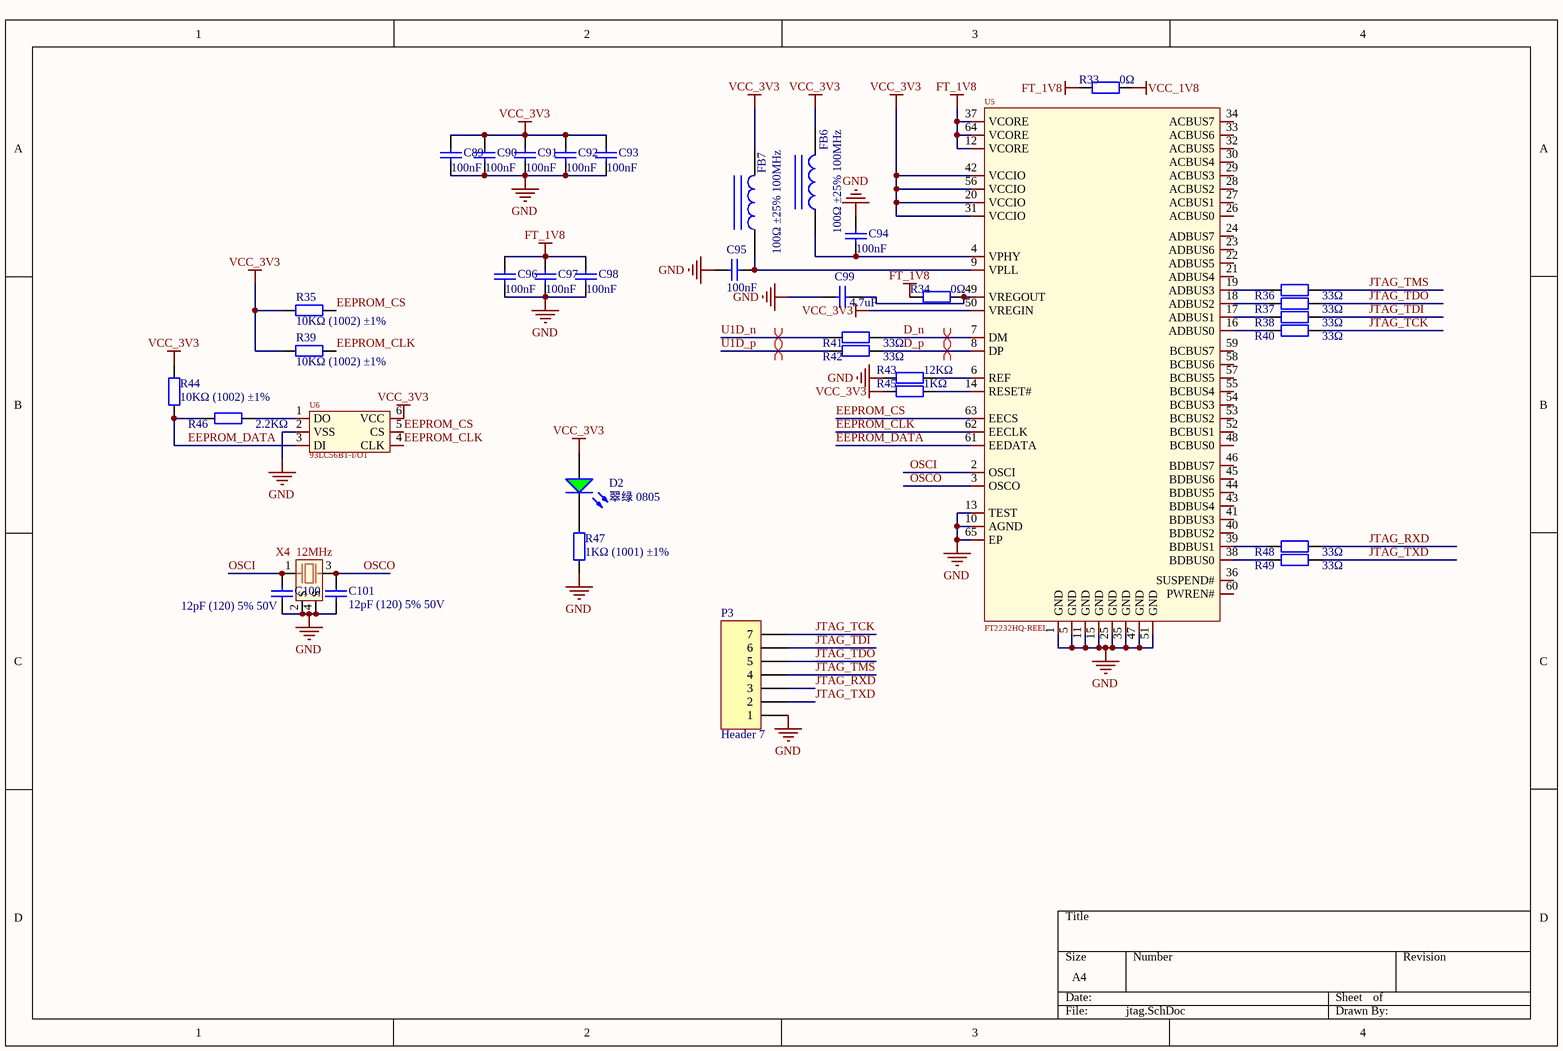
[diagram p2: jtag.SchDoc]

### Parts
C89  100nF  [0402_C]
C90  100nF  [0402_C]
C91  100nF  [0402_C]
C92  100nF  [0402_C]
C93  100nF  [0402_C]
C94  100nF  [0402_C]
C95  100nF  [0402_C]
C96  100nF  [0402_C]
C97  100nF  [0402_C]
C98  100nF  [0402_C]
C99  4.7uF  [0402_C]
C100  12pF (120) 5% 50V  [0402_C]
C101  12pF (120) 5% 50V  [0402_C]
D2  翠绿 0805  [0805_LED_S1]
FB6  100Ω ±25% 100MHz  [0805_L]
FB7  100Ω ±25% 100MHz  [0805_L]
P3  Header 7  [HDR1X7]
R33  0Ω  [0402_R]
R34  0Ω  [0402_R]
R35  10KΩ (1002) ±1%  [0402_R]
R36  33Ω  [0402]
R37  33Ω  [0402]
R38  33Ω  [0402]
R39  10KΩ (1002) ±1%  [0402_R]
R40  33Ω  [0402]
R41  33Ω  [0402_R]
R42  33Ω  [0402_R]
R43  12KΩ  [0402_R]
R44  10KΩ (1002) ±1%  [0402_R]
R45  1KΩ  [0402_R]
R46  2.2KΩ  [0402_R]
R47  1KΩ (1001) ±1%  [0805_R]
R48  33Ω  [0402]
R49  33Ω  [0402]
U5  FT2232HQ-REEL  [QFN-64_L9.0-W9.0-P0.50-TL-EP4.3]
U6  93LC56BT-I/OT  [SOT-23-6_L2.9-W1.6-P0.95-LS2.8-BR]
X4  12MHz  [3225]

### Nets
FT_1V8: C96.2 C97.2 C98.2 R33.1 R34.1 U5.12(VCORE) U5.37(VCORE) U5.64(VCORE)
GND: C89.1 C90.1 C91.1 C92.1 C93.1 C94.2 C95.2 C96.1 C97.1 C98.1 C99.1 C100.1 C101.1 P3.1 R43.1 R47.1 U5.1(GND) U5.5(GND) U5.10(AGND) U5.11(GND) U5.13(TEST) U5.15(GND) U5.25(GND) U5.35(GND) U5.47(GND) U5.51(GND) U5.65(EP) U6.2(VSS) X4.2(S) X4.4(S)
VCC_1V8: R33.2
VCC_3V3: C89.2 C90.2 C91.2 C92.2 C93.2 D2.A FB6.2 FB7.2 R35.2 R39.2 R44.2 R45.1 U5.20(VCCIO) U5.31(VCCIO) U5.42(VCCIO) U5.50(VREGIN) U5.56(VCCIO) U6.6(VCC)
D_n: R41.2 U5.7(DM)
D_p: R42.2 U5.8(DP)
EEPROM_CLK: R39.1 U5.62(EECLK) U6.4(CLK)
EEPROM_CS: R35.1 U5.63(EECS) U6.5(CS)
EEPROM_DATA: R44.1 R46.1 U5.61(EEDATA) U6.3(DI)
JTAG_RXD: P3.3 R48.2
JTAG_TCK: P3.7 R40.2
JTAG_TDI: P3.6 R38.2
JTAG_TDO: P3.5 R37.2
JTAG_TMS: P3.4 R36.2
JTAG_TXD: P3.2 R49.2
OSCI: C100.2 U5.2(OSCI) X4.1
OSCO: C101.2 U5.3(OSCO) X4.3
U1D_n: R41.1
U1D_p: R42.1
NetC94_1: C94.1 FB6.1 U5.4(VPHY)
NetC95_1: C95.1 FB7.1 U5.9(VPLL)
NetC99_2: C99.2 R34.2 U5.49(VREGOUT)
NetD2_K: D2.K R47.2
NetR36_1: R36.1 U5.19(ADBUS3)
NetR37_1: R37.1 U5.18(ADBUS2)
NetR38_1: R38.1 U5.17(ADBUS1)
NetR40_1: R40.1 U5.16(ADBUS0)
NetR43_2: R43.2 U5.6(REF)
NetR45_2: R45.2 U5.14(RESET#)
NetR46_2: R46.2 U6.1(DO)
NetR48_1: R48.1 U5.39(BDBUS1)
NetR49_1: R49.1 U5.38(BDBUS0)

Not connected (* = marked no-connect by the designer): U5 21(ADBUS4) 22(ADBUS5) 23(ADBUS6) 24(ADBUS7) 26(ACBUS0) 27(ACBUS1) 28(ACBUS2) 29(ACBUS3) 30(ACBUS4) 32(ACBUS5) 33(ACBUS6) 34(ACBUS7) 36(SUSPEND#) 40(BDBUS2) 41(BDBUS3) 43(BDBUS4) 44(BDBUS5) 45(BDBUS6) 46(BDBUS7) 48(BCBUS0) 52(BCBUS1) 53(BCBUS2) 54(BCBUS3) 55(BCBUS4) 57(BCBUS5) 58(BCBUS6) 59(BCBUS7) 60(PWREN#)

### Layout directives
differential pair: D_n, D_p, U1D_n, U1D_p

### Library data of the parts
C89-C98 = 0805 100nF(104) 10% 50V: 贴片电容; ComponentLink1Description: 供应商链接; ComponentLink1URL: http://www.szlcsc.com/product/details_50686.html; Package: 0805; Supplier: LC; SuppliersPartNumber: C49678
C99 = 0805 4.7uF (475) 10% 25V: 贴片电容; ComponentLink1Description: 供应商链接; ComponentLink1URL: http://www.szlcsc.com/product/details_2131.html; Package: 0805; Supplier: LC; SuppliersPartNumber: C1779
C100 C101 = 0805 12pF (120) 5% 50V: 贴片电容; ComponentLink1Description: 供应商链接; ComponentLink1URL: http://www.szlcsc.com/product/details_2144.html; Package: 0805; Supplier: LC; SuppliersPartNumber: C1792
D2 = 0805 翠绿: 发光二极管; ComponentLink1Description: 供应商链接; ComponentLink1URL: http://www.szlcsc.com/product/details_2670.html; Package: 0805; Supplier: LC; SuppliersPartNumber: C2297
FB6 FB7 = 0805 100Ω 25% 100MHz: 贴片磁珠; ComponentLink1Description: 供应商链接; ComponentLink1URL: http://www.szlcsc.com/product/details_1367.html; Package: 0805; Supplier: LC; SuppliersPartNumber: C1015
P3 = Header 7: Header, 7-Pin; LatestRevisionDate: 17-Jul-2002; LatestRevisionNote: Re-released for DXP Platform.; Publisher: Altium Limited
R33 R34 = 0402 0Ω (0R0) 1%: 贴片电阻; ComponentLink1Description: 供应商链接; ComponentLink1URL: http://www.szlcsc.com/product/details_17853.html; Package: 0402; Supplier: LC; SuppliersPartNumber: C17168
R35 R39 R44 = 0805 10KΩ (1002) 1%: 贴片电阻; ComponentLink1Description: 供应商链接; ComponentLink1URL: http://www.szlcsc.com/product/details_18102.html; Package: 0805; Supplier: LC; SuppliersPartNumber: C17414
R36-R38 R40-R42 R48 R49 = 0805 33Ω (33R0) 1%: 贴片电阻; ComponentLink1Description: 供应商链接; ComponentLink1URL: http://www.szlcsc.com/product/details_18322.html; Package: 0805; Supplier: LC; SuppliersPartNumber: C17634
R43 = 0805 12KΩ (1202) 1%: 贴片电阻; ComponentLink1Description: 供应商链接; ComponentLink1URL: http://www.szlcsc.com/product/details_18132.html; Package: 0805; Supplier: LC; SuppliersPartNumber: C17444
R45 R47 = 0805 1KΩ (1001) 1%: 贴片电阻; ComponentLink1Description: 供应商链接; ComponentLink1URL: http://www.szlcsc.com/product/details_18201.html; Package: 0805; Supplier: LC; SuppliersPartNumber: C17513
R46 = 0805 2.2KΩ (2201) 1%: 贴片电阻; ComponentLink1Description: 供应商链接; ComponentLink1URL: http://www.szlcsc.com/product/details_18208.html; Package: 0805; Supplier: LC; SuppliersPartNumber: C17520
U5 = FT2232HQ-REEL: Manufacturer: FTDI(飞特帝亚); Add into BOM: yes; Applications Function: USB转UART；USB转FIFO; Supply Voltage: 3V~3.6V; Symbol: FT2232HQ-REEL; Device: FT2232HQ-REEL; LCSC Part Name: FT2232H 双高速 USB 转多用途 UART/FIFO IC; Supplier Part: C193662; Manufacturer Part: FT2232HQ-REEL; Supplier Footprint: QFN-64-EP(9x9); JLCPCB Part Class: Extended Part; Datasheet: https://atta.szlcsc.com/upload/public/pdf/source/20180530/C193662_F14B45A4B5271BE746E436B0F2E041EE.pdf; Supplier: LCSC; Convert to PCB: yes; Protocol: -; Operating Temperature: -40℃~+85℃
U6 = 93LC56BT-I/OT: Manufacturer: MICROCHIP(美国微芯); Add into BOM: yes; Interface Type: SPI; Memory Size: 2Kbit; Supply Voltage: 2.5V~5.5V; Write Cycle Time (Tw): 6ms; Data Retention - TDR (Year): 200年; Write Cycle Endurance: 1000000次; Symbol: 93LC56BT-I/OT; Device: 93LC56BT-I/OT; LCSC Part Name: 93LC56BT-I/OT; Supplier Part: C190271; Manufacturer Part: 93LC56BT-I/OT; Supplier Footprint: SOT-23-6; JLCPCB Part Class: Extended Part; Datasheet: https://atta.szlcsc.com/upload/public/pdf/source/20140724/1457707164359.pdf; Supplier: LCSC; Convert to PCB: yes; Operating Temperature: -40℃~+85℃
X4 = 四脚无源晶体: as X1 on sheet mcu; Device: TAXM8M4RDBCCT2T; LCSC Part Name: 8MHz ±10ppm 10pF; Supplier Part: C400090; Manufacturer Part: TAXM8M4RDBCCT2T; Supplier Footprint: SMD3225-4P; JLCPCB Part Class: Extended Part; Datasheet: https://atta.szlcsc.com/upload/public/pdf/source/20190626/C400090_CF95B89E745AFE4EF2E392EF8AC009D6.pdf; Supplier: LCSC; Convert to PCB: yes; Type: 贴片晶振; Operating Temperature: -40℃~+85℃

## Sheet power.SchDoc
size A4; SheetNumber: 4; SheetTotal: 5
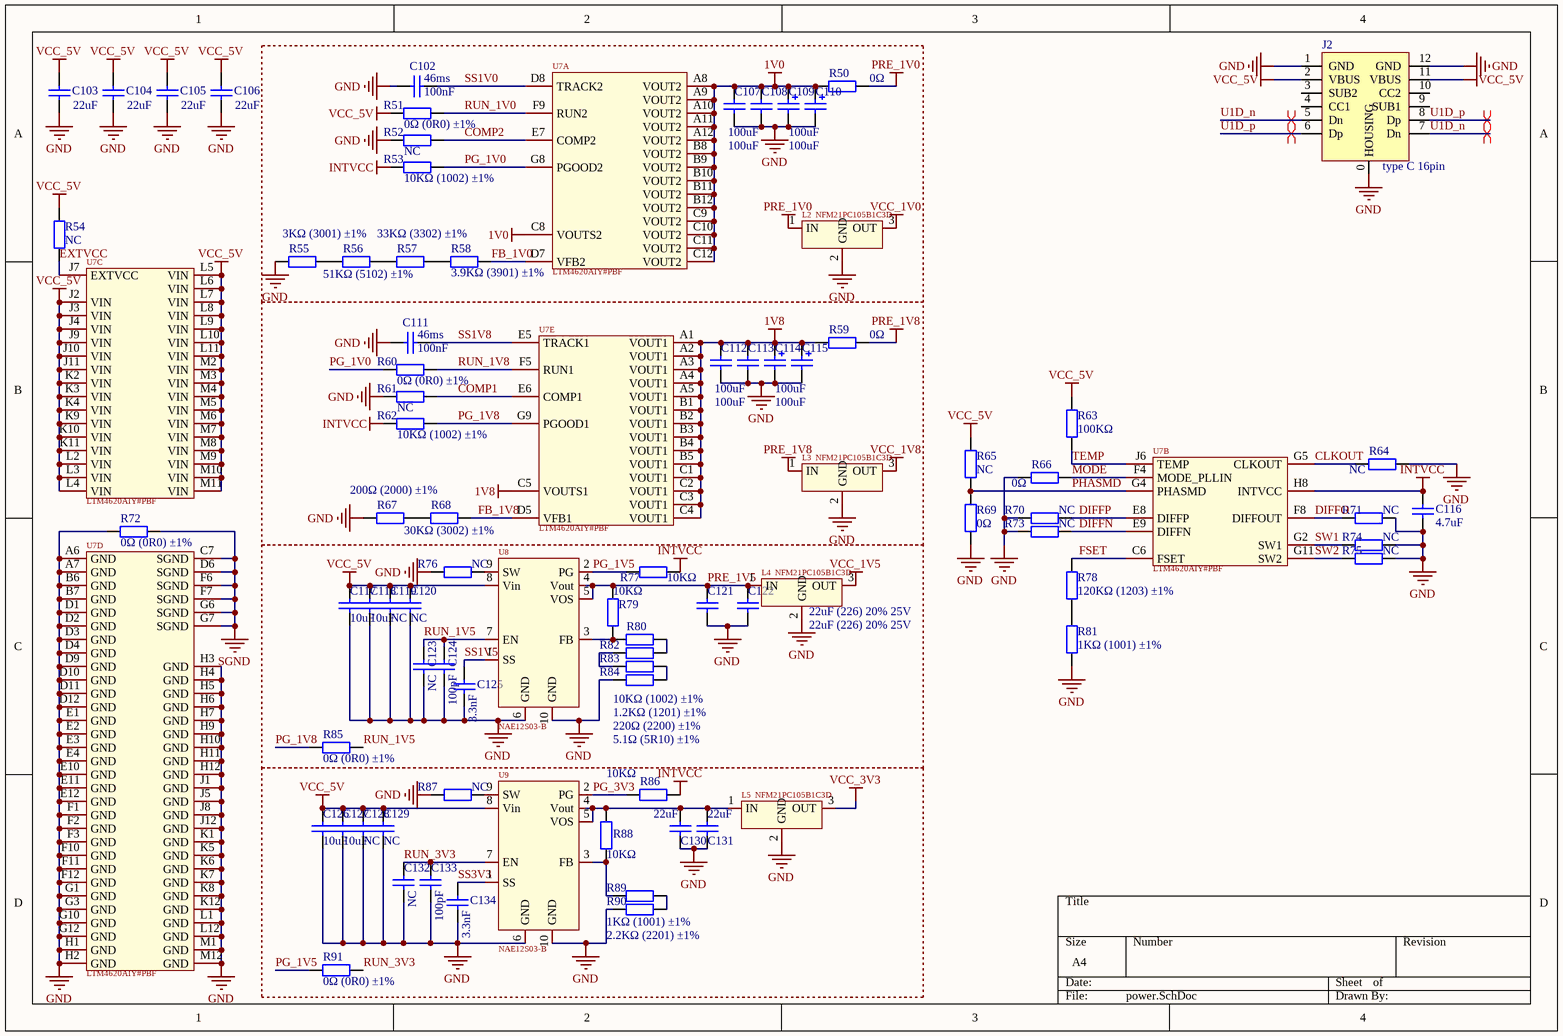
[diagram p3: power.SchDoc]

### Parts
C102  100nF  [0805_C]
C103  22uF  [0805_C]
C104  22uF  [0805_C]
C105  22uF  [0805_C]
C106  22uF  [0805_C]
C107  100uF  [1206_C]
C108  100uF  [1206_C]
C109  100uF  [CASE-B_3528]
C110  100uF  [CASE-B_3528]
C111  100nF  [0805_C]
C112  100uF  [1206_C]
C113  100uF  [1206_C]
C114  100uF  [CASE-B_3528]
C115  100uF  [CASE-B_3528]
C116  4.7uF  [0805_C]
C117  10uF  [0805_C]
C118  10uF  [0805_C]
C119  NC  [0805_C]
C120  NC  [0805_C]
C121  22uF (226) 20% 25V  [0805_C]
C122  22uF (226) 20% 25V  [0805_C]
C123  NC  [0805_C]
C124  100pF  [0805_C]
C125  3.3nF  [0805_C]
C126  10uF  [0805_C]
C127  10uF  [0805_C]
C128  NC  [0805_C]
C129  NC  [0805_C]
C130  22uF  [0805_C]
C131  22uF  [0805_C]
C132  NC  [0805_C]
C133  100pF  [0805_C]
C134  3.3nF  [0805_C]
J2  type C 16pin  [USB type C  16pin]
L2  NFM21PC105B1C3D  [FILTER-SMD_3P-L2.0-W1.2-L]
L3  NFM21PC105B1C3D  [FILTER-SMD_3P-L2.0-W1.2-L]
L4  NFM21PC105B1C3D  [FILTER-SMD_3P-L2.0-W1.2-L]
L5  NFM21PC105B1C3D  [FILTER-SMD_3P-L2.0-W1.2-L]
R50  0Ω  [0805_R]
R51  0Ω (0R0) ±1%  [0805_R]
R52  NC  [0805_R]
R53  10KΩ (1002) ±1%  [0805_R]
R54  NC  [0805_R]
R55  3KΩ (3001) ±1%  [0805_R]
R56  51KΩ (5102) ±1%  [0805_R]
R57  33KΩ (3302) ±1%  [0805_R]
R58  3.9KΩ (3901) ±1%  [0805_R]
R59  0Ω  [0805_R]
R60  0Ω (0R0) ±1%  [0805_R]
R61  NC  [0805_R]
R62  10KΩ (1002) ±1%  [0805_R]
R63  100KΩ  [0805_R]
R64  NC  [0805_R]
R65  NC  [0805_R]
R66  0Ω  [0805_R]
R67  200Ω (2000) ±1%  [0805_R]
R68  30KΩ (3002) ±1%  [0805_R]
R69  0Ω  [0805_R]
R70  NC  [0805_R]
R71  NC  [0805_R]
R72  0Ω (0R0) ±1%  [0402_R]
R73  NC  [0805_R]
R74  NC  [0805_R]
R75  NC  [0805_R]
R76  NC  [0805_R]
R77  10KΩ  [0805_R]
R78  120KΩ (1203) ±1%  [0805_R]
R79  10KΩ  [0805_R]
R80  10KΩ (1002) ±1%  [0805_R]
R81  1KΩ (1001) ±1%  [0805_R]
R82  1.2KΩ (1201) ±1%  [0805_R]
R83  220Ω (2200) ±1%  [0805_R]
R84  5.1Ω (5R10) ±1%  [0805_R]
R85  0Ω (0R0) ±1%  [0805_R]
R86  10KΩ  [0805_R]
R87  NC  [0805_R]
R88  10KΩ  [0805_R]
R89  2.2KΩ (2201) ±1%  [0805_R]
R90  1KΩ (1001) ±1%  [0805_R]
R91  0Ω (0R0) ±1%  [0805_R]
U7  LTM4620AIY#PBF  [BGA-144_L15.0-W15.0-R12-C12-P1.27-BL]  (parts A,B,C,D,E of 5)
U8  NAE12S03-B  [PWRM-SMD_HUAWEI_NAE12S03]
U9  NAE12S03-B  [PWRM-SMD_HUAWEI_NAE12S03]

### Blocks framed on the sheet
46ms: C102 C107-C110 L2 R50-R53 R55-R58 U7
46ms: C111-C115 L3 R59-R62 R67 R68 U7

### Nets
1V0: C107.2 C108.2 C109.1 C110.1 R50.1 U7.A8(VOUT2) U7.A9(VOUT2) U7.A10(VOUT2) U7.A11(VOUT2) U7.A12(VOUT2) U7.B8(VOUT2) U7.B9(VOUT2) U7.B10(VOUT2) U7.B11(VOUT2) U7.B12(VOUT2) U7.C8(VOUTS2) U7.C9(VOUT2) U7.C10(VOUT2) U7.C11(VOUT2) U7.C12(VOUT2)
1V8: C112.2 C113.2 C114.1 C115.1 R59.1 U7.A1(VOUT1) U7.A2(VOUT1) U7.A3(VOUT1) U7.A4(VOUT1) U7.A5(VOUT1) U7.B1(VOUT1) U7.B2(VOUT1) U7.B3(VOUT1) U7.B4(VOUT1) U7.B5(VOUT1) U7.C1(VOUT1) U7.C2(VOUT1) U7.C3(VOUT1) U7.C4(VOUT1) U7.C5(VOUTS1)
GND: C102.2 C103.1 C104.1 C105.1 C106.1 C107.1 C108.1 C109.2 C110.2 C111.2 C112.1 C113.1 C114.2 C115.2 C116.1 C117.1 C118.1 C119.1 C120.1 C121.1 C122.1 C123.1 C124.1 C125.1 C126.1 C127.1 C128.1 C129.1 C130.1 C131.1 C132.1 C133.1 C134.1 J2.0(HOUSING) J2.1(GND) J2.12(GND) L2.2(GND) L3.2(GND) L4.2(GND) L5.2(GND) R52.1 R55.2 R61.1 R64.1 R66.2 R67.1 R69.1 R70.2 R71.1 R72.2 R73.2 R74.1 R75.1 R76.2 R81.1 R84.2 R87.2 R90.2 U7.A6(GND) U7.A7(GND) U7.B6(GND) U7.B7(GND) U7.D1(GND) U7.D2(GND) U7.D3(GND) U7.D4(GND) U7.D9(GND) U7.D10(GND) U7.D11(GND) U7.D12(GND) U7.E1(GND) U7.E2(GND) U7.E3(GND) U7.E4(GND) U7.E10(GND) U7.E11(GND) U7.E12(GND) U7.F1(GND) U7.F2(GND) U7.F3(GND) U7.F10(GND) U7.F11(GND) U7.F12(GND) U7.G1(GND) U7.G3(GND) U7.G10(GND) U7.G12(GND) U7.H1(GND) U7.H2(GND) U7.H3(GND) U7.H4(GND) U7.H5(GND) U7.H6(GND) U7.H7(GND) U7.H9(GND) U7.H10(GND) U7.H11(GND) U7.H12(GND) U7.J1(GND) U7.J5(GND) U7.J8(GND) U7.J12(GND) U7.K1(GND) U7.K5(GND) U7.K6(GND) U7.K7(GND) U7.K8(GND) U7.K12(GND) U7.L1(GND) U7.L12(GND) U7.M1(GND) U7.M12(GND) U8.6(GND) U8.10(GND) U9.6(GND) U9.10(GND)
INTVCC: C116.2 R53.2 R62.2 R77.2 R86.2 U7.H8(INTVCC)
PRE_1V0: L2.1(IN) R50.2
PRE_1V8: L3.1(IN) R59.2
SGND: R72.1 U7.C7(SGND) U7.D6(SGND) U7.F6(SGND) U7.F7(SGND) U7.G6(SGND) U7.G7(SGND)
VCC_1V0: L2.3(OUT)
VCC_1V5: L4.3(OUT)
VCC_1V8: L3.3(OUT)
VCC_3V3: L5.3(OUT)
VCC_5V: C103.2 C104.2 C105.2 C106.2 C117.2 C118.2 C119.2 C120.2 C126.2 C127.2 C128.2 C129.2 J2.2(VBUS) J2.11(VBUS) R51.2 R54.1 R63.2 R65.2 U7.J2(VIN) U7.J3(VIN) U7.J4(VIN) U7.J9(VIN) U7.J10(VIN) U7.J11(VIN) U7.K2(VIN) U7.K3(VIN) U7.K4(VIN) U7.K9(VIN) U7.K10(VIN) U7.K11(VIN) U7.L2(VIN) U7.L3(VIN) U7.L4(VIN) U7.L5(VIN) U7.L6(VIN) U7.L7(VIN) U7.L8(VIN) U7.L9(VIN) U7.L10(VIN) U7.L11(VIN) U7.M2(VIN) U7.M3(VIN) U7.M4(VIN) U7.M5(VIN) U7.M6(VIN) U7.M7(VIN) U7.M8(VIN) U7.M9(VIN) U7.M10(VIN) U7.M11(VIN) U8.8(Vin) U9.8(Vin)
CLKOUT: R64.2 U7.G5(CLKOUT)
COMP1: R61.2 U7.E6(COMP1)
COMP2: R52.2 U7.E7(COMP2)
DIFFN: R73.1 U7.E9(DIFFN)
DIFFO: R71.2 U7.F8(DIFFOUT)
DIFFP: R70.1 U7.E8(DIFFP)
EXTVCC: R54.2 U7.J7(EXTVCC)
FB_1V0: R58.2 U7.D7(VFB2)
FB_1V8: R68.2 U7.D5(VFB1)
FSET: R78.2 U7.C6(FSET)
MODE: R66.1 U7.F4(MODE_PLLIN)
PG_1V0: R53.1 R60.2 U7.G8(PGOOD2)
PG_1V5: R77.1 R91.2 U8.2(PG)
PG_1V8: R62.1 R85.2 U7.G9(PGOOD1)
PG_3V3: R86.1 U9.2(PG)
PHASMD: R65.1 R69.2 U7.G4(PHASMD)
PRE_1V5: C121.2 C122.2 L4.1(IN) R79.2 U8.4(Vout) U8.5(VOS)
RUN_1V0: R51.1 U7.F9(RUN2)
RUN_1V5: C123.2 C124.2 R85.1 U8.7(EN)
RUN_1V8: R60.1 U7.F5(RUN1)
RUN_3V3: C132.2 C133.2 R91.1 U9.7(EN)
SS1V0: C102.1 U7.D8(TRACK2)
SS1V5: C125.2 U8.1(SS)
SS1V8: C111.1 U7.E5(TRACK1)
SS3V3: C134.2 U9.1(SS)
SW1: R74.2 U7.G2(SW1)
SW2: R75.2 U7.G11(SW2)
TEMP: R63.1 U7.J6(TEMP)
U1D_n: J2.5(Dn) J2.7(Dn)
U1D_p: J2.6(Dp) J2.8(Dp)
NetC130_2: C130.2 C131.2 L5.1(IN) R88.2 U9.4(Vout) U9.5(VOS)
NetR55_1: R55.1 R56.1
NetR56_2: R56.2 R57.1
NetR57_2: R57.2 R58.1
NetR67_2: R67.2 R68.1
NetR76_1: R76.1 U8.9(SW)
NetR78_1: R78.1 R81.2
NetR79_1: R79.1 R80.1 U8.3(FB)
NetR80_2: R80.2 R82.1
NetR82_2: R82.2 R83.2
NetR83_1: R83.1 R84.1
NetR87_1: R87.1 U9.9(SW)
NetR88_1: R88.1 R89.1 U9.3(FB)
NetR89_2: R89.2 R90.1

Not connected (* = marked no-connect by the designer): J2 3(SUB2) 4(CC1) 9(SUB1) 10(CC2)

### Layout directives
differential pair: U1D_n, U1D_p

### Library data of the parts
C102 C111 = 0805 100nF(104) 10% 50V: 贴片电容; ComponentLink1Description: 供应商链接; ComponentLink1URL: http://www.szlcsc.com/product/details_50686.html; Package: 0805; Supplier: LC; SuppliersPartNumber: C49678
C103-C106 C121 C122 C130 C131 = 0805 22uF (226) 20% 25V: 贴片电容; ComponentLink1Description: 供应商链接; ComponentLink1URL: http://www.szlcsc.com/product/details_46786.html; Package: 0805; Supplier: LC; SuppliersPartNumber: C45783
C107 C108 C112 C113 = 1206 100nF (104) 10% 50V: 贴片电容; ComponentLink1Description: 供应商链接; ComponentLink1URL: http://www.szlcsc.com/product/details_25237.html; Package: 1206; Supplier: LC; SuppliersPartNumber: C24497
C109 C110 C114 C115 = 3528 100uF (107) 10% 6.3V: 钽电容; ComponentLink1Description: 供应商链接; ComponentLink1URL: http://www.szlcsc.com/product/details_16815.html; Package: 3528; Supplier: LC; SuppliersPartNumber: C16133
C116 = 0805 4.7uF (475) 10% 25V: 贴片电容; ComponentLink1Description: 供应商链接; ComponentLink1URL: http://www.szlcsc.com/product/details_2131.html; Package: 0805; Supplier: LC; SuppliersPartNumber: C1779
C117-C120 C126-C129 = 0805 10uF (106) 10% 25V: 贴片电容; ComponentLink1Description: 供应商链接; ComponentLink1URL: http://www.szlcsc.com/product/details_16532.html; Package: 0805; Supplier: LC; SuppliersPartNumber: C15850
C123 C124 C132 C133 = 0805 100pF (101) 5% 50V: 贴片电容; ComponentLink1Description: 供应商链接; ComponentLink1URL: http://www.szlcsc.com/product/details_2142.html; Package: 0805; Supplier: LC; SuppliersPartNumber: C1790
C125 C134 = 0805 3.3nF (332) 10% 50V: 贴片电容; ComponentLink1Description: 供应商链接; ComponentLink1URL: http://www.szlcsc.com/product/details_54191.html; Package: 0805; Supplier: LC; SuppliersPartNumber: C53175
J2 = USB type C 16pin: 16针脚C口
L2-L5 = NFM21PC105B1C3D: 穿心电容; Manufacturer: muRata(村田); Add into BOM: yes; Nominal Capacitance: 1uF; CapacitanceTolerance: ±20%; DC Rated Voltage: 16V; Rated Current: 4A; DC Resistance: 20mΩ; Symbol: NFM21PC105B1C3D; Device: NFM21PC105B1C3D; LCSC Part Name: 1.0uF(105) ±20%16V; Supplier Part: C92518; Manufacturer Part: NFM21PC105B1C3D; Supplier Footprint: SMD-3P,1.2x2mm; JLCPCB Part Class: Extended Part; Datasheet: https://atta.szlcsc.com/upload/public/pdf/source/20170105/1483610797228.pdf; Supplier: LCSC; Convert to PCB: yes; Operating Temperature: -40℃~+85℃
R50 R51 R59 R60 R64-R66 R69-R76 R85 R87 R91 = 0805 0Ω (0R0) 1%: 贴片电阻; ComponentLink1Description: 供应商链接; ComponentLink1URL: http://www.szlcsc.com/product/details_18165.html; Package: 0805; Supplier: LC; SuppliersPartNumber: C17477
R52 R57 R61 R68 = 0805 33KΩ (3302) 1%: 贴片电阻; ComponentLink1Description: 供应商链接; ComponentLink1URL: http://www.szlcsc.com/product/details_18321.html; Package: 0805; Supplier: LC; SuppliersPartNumber: C17633
R53 R62 R77 R79 R80 R86 R88 = 0805 10KΩ (1002) 1%: 贴片电阻; ComponentLink1Description: 供应商链接; ComponentLink1URL: http://www.szlcsc.com/product/details_18102.html; Package: 0805; Supplier: LC; SuppliersPartNumber: C17414
R54 R55 = 0805 3KΩ (3001) 1%: 贴片电阻; ComponentLink1Description: 供应商链接; ComponentLink1URL: http://www.szlcsc.com/product/details_18349.html; Package: 0805; Supplier: LC; SuppliersPartNumber: C17661
R56 = 0805 51KΩ (5102) 1%: 贴片电阻; ComponentLink1Description: 供应商链接; ComponentLink1URL: http://www.szlcsc.com/product/details_18425.html; Package: 0805; Supplier: LC; SuppliersPartNumber: C17737
R58 = 0805 3.9KΩ (3901) 1%: 贴片电阻; ComponentLink1Description: 供应商链接; ComponentLink1URL: http://www.szlcsc.com/product/details_18302.html; Package: 0805; Supplier: LC; SuppliersPartNumber: C17614
R63 = 0805 100KΩ (1003) 1%: 贴片电阻; ComponentLink1Description: 供应商链接; ComponentLink1URL: http://www.szlcsc.com/product/details_18095.html; Package: 0805; Supplier: LC; SuppliersPartNumber: C17407
R67 = 0805 200Ω (2000) 1%: 贴片电阻; ComponentLink1Description: 供应商链接; ComponentLink1URL: http://www.szlcsc.com/product/details_18228.html; Package: 0805; Supplier: LC; SuppliersPartNumber: C17540
R78 = 0402 120KΩ (1203) 1%: 贴片电阻; ComponentLink1Description: 供应商链接; ComponentLink1URL: http://www.szlcsc.com/product/details_26493.html; Package: 0402; Supplier: LC; SuppliersPartNumber: C25750
R81 = 0402 1KΩ (1001) 1%: 贴片电阻; ComponentLink1Description: 供应商链接; ComponentLink1URL: http://www.szlcsc.com/product/details_12256.html; Package: 0402; Supplier: LC; SuppliersPartNumber: C11702
R82 = 0805 1.2KΩ (1201) 1%: 贴片电阻; ComponentLink1Description: 供应商链接; ComponentLink1URL: http://www.szlcsc.com/product/details_18067.html; Package: 0805; Supplier: LC; SuppliersPartNumber: C17379
R83 = 0805 220Ω (2200) 1%: 贴片电阻; ComponentLink1Description: 供应商链接; ComponentLink1URL: http://www.szlcsc.com/product/details_18245.html; Package: 0805; Supplier: LC; SuppliersPartNumber: C17557
R84 = 0805 5.1Ω (5R10) 1%: 贴片电阻; ComponentLink1Description: 供应商链接; ComponentLink1URL: http://www.szlcsc.com/product/details_18412.html; Package: 0805; Supplier: LC; SuppliersPartNumber: C17724
R89 = 0805 2.2KΩ (2201) 1%: 贴片电阻; ComponentLink1Description: 供应商链接; ComponentLink1URL: http://www.szlcsc.com/product/details_18208.html; Package: 0805; Supplier: LC; SuppliersPartNumber: C17520
R90 = 0805 1KΩ (1001) 1%: 贴片电阻; ComponentLink1Description: 供应商链接; ComponentLink1URL: http://www.szlcsc.com/product/details_18201.html; Package: 0805; Supplier: LC; SuppliersPartNumber: C17513
U7 = LTM4620AIY#PBF: ADI电源; Manufacturer: ADI(亚德诺); Add into BOM: yes; Conversion Type: DC-DC; Input Voltage(DC): 4.5V~16V; Output Voltage: 0.6V~5.3V; Output Current (Max): 13A; Output Channel: 2; Symbol: LTM4620AIY#PBF; Device: LTM4620AIY#PBF; LCSC Part Name: 双通道 13A 或单通道 26A DC/DC uModule 稳压器; Supplier Part: C108015; Manufacturer Part: LTM4620AIY#PBF; Supplier Footprint: BGA-144(15x15); JLCPCB Part Class: Extended Part; Datasheet: https://atta.szlcsc.com/upload/public/pdf/source/20191223/C471410_9980ECA8DA2BC0F921CA49592D580556.pdf; Supplier: LCSC; Convert to PCB: yes; Output Power: -; Insulated Voltage: -; Conversion Efficiency: -; Feature: 过压保护；欠压保护；过流保护; Maximum Capacitive Load: -
U8 U9 = NAE12S03-B: 华为电源模块; Manufacturer: HUAWEI(华为); Add into BOM: yes; Conversion Type: DC-DC; Input Voltage(DC): 6.3V~14V; Output Voltage: 0.8V~5.2V; Output Power: 15W; Output Current (Max): 3A; Output Channel: 1; Maximum Capacitive Load: 500uF; Symbol: NAE12S03-B; Device: NAE12S03-B; LCSC Part Name: NAE12S03-B; Supplier Part: C5632472; Manufacturer Part: NAE12S03-B; Supplier Footprint: -; JLCPCB Part Class: Extended Part; Datasheet: https://atta.szlcsc.com/upload/public/pdf/source/20230428/342BA0ED97D448F86BA8DB326342F56D.pdf; Supplier: LCSC; Convert to PCB: yes

## Sheet debug.SchDoc
size A4; SheetNumber: 5; SheetTotal: 5
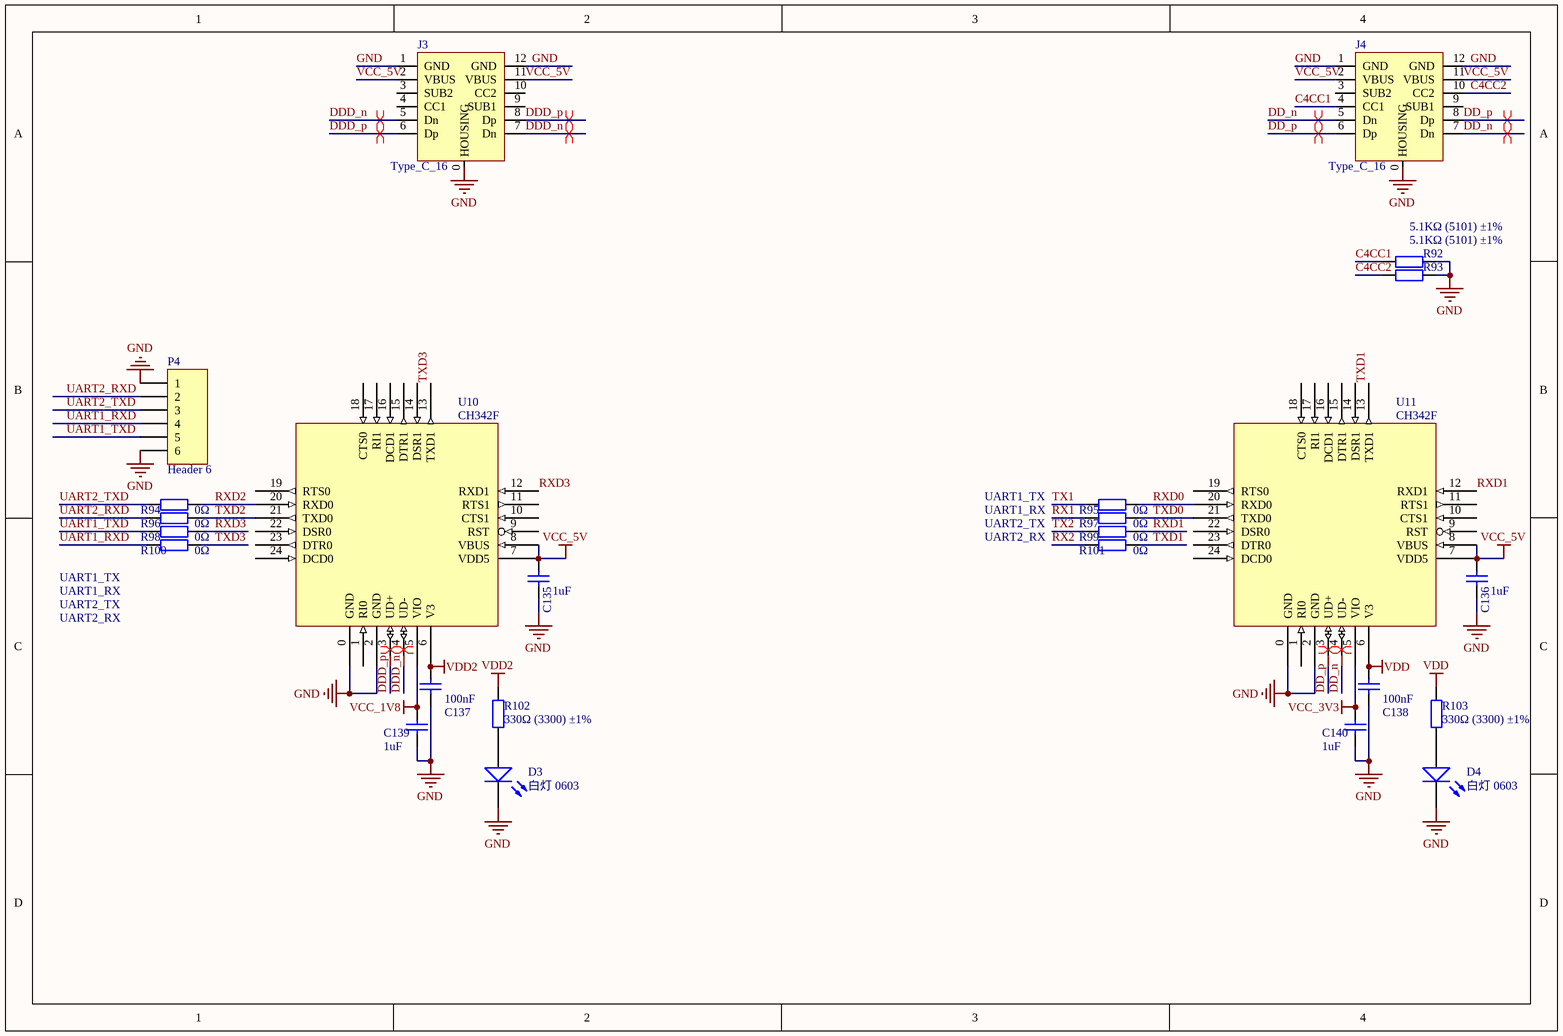
[diagram p4: debug.SchDoc]

### Parts
C135  1uF  [0805_C]
C136  1uF  [0402_C]
C137  100nF  [0805_C]
C138  100nF  [0402_C]
C139  1uF  [0805_C]
C140  1uF  [0402_C]
D3  白灯 0603  [0805_LED_S1]
D4  白灯 0603  [0805_LED_S1]
J3  Type_C_16  [USB type C  16pin]
J4  Type_C_16  [USB type C  16pin]
P4  Header 6  [HDR1X6]
R92  5.1KΩ (5101) ±1%  [0402_R]
R93  5.1KΩ (5101) ±1%  [0402_R]
R94  0Ω  [0805_R]
R95  0Ω  [0805_R]
R96  0Ω  [0805_R]
R97  0Ω  [0805_R]
R98  0Ω  [0805_R]
R99  0Ω  [0805_R]
R100  0Ω  [0805_R]
R101  0Ω  [0805_R]
R102  330Ω (3300) ±1%  [0805_R]
R103  330Ω (3300) ±1%  [0805_R]
U10  CH342F  [QFN24_4X4]
U11  CH342F  [QFN24_4X4]

### Nets
GND: C135.1 C136.1 C137.1 C138.1 C139.1 C140.1 D3.K D4.K J3.0(HOUSING) J3.1(GND) J3.12(GND) J4.0(HOUSING) J4.1(GND) J4.12(GND) P4.1 P4.6 R92.1 R93.1 U10.0(GND) U10.2(GND) U11.0(GND) U11.2(GND)
VCC_1V8: C139.2 U10.5(VIO)
VCC_3V3: C140.2 U11.5(VIO)
VCC_5V: C135.2 C136.2 J3.2(VBUS) J3.11(VBUS) J4.2(VBUS) J4.11(VBUS) U10.7(VDD5) U10.8(VBUS) U11.7(VDD5) U11.8(VBUS)
VDD: C138.2 R103.2 U11.6(V3)
VDD2: C137.2 R102.2 U10.6(V3)
C4CC1: J4.4(CC1) R92.2
C4CC2: J4.10(CC2) R93.2
DD_n: J4.5(Dn) J4.7(Dn) U11.4(UD-)
DD_p: J4.6(Dp) J4.8(Dp) U11.3(UD+)
DDD_n: J3.5(Dn) J3.7(Dn) U10.4(UD-)
DDD_p: J3.6(Dp) J3.8(Dp) U10.3(UD+)
RX1: R97.1
RX2: R101.1
RXD0: R95.2 U11.20(RXD0)
RXD1: R99.2 U11.12(RXD1)
RXD2: R94.2 U10.20(RXD0)
RXD3: R98.2 U10.12(RXD1)
TX1: R95.1
TX2: R99.1
TXD0: R97.2 U11.21(TXD0)
TXD1: R101.2 U11.13(TXD1)
TXD2: R96.2 U10.21(TXD0)
TXD3: R100.2 U10.13(TXD1)
UART1_RXD: P4.4 R100.1
UART1_TXD: P4.5 R98.1
UART2_RXD: P4.2 R96.1
UART2_TXD: P4.3 R94.1
NetD3_A: D3.A R102.1
NetD4_A: D4.A R103.1

Not connected (* = marked no-connect by the designer): J3 3(SUB2) 4(CC1) 9(SUB1) 10(CC2); J4 3(SUB2) 9(SUB1); U10 1(RI0) 9(RST) 10(CTS1) 11(RTS1) 14(DSR1) 15(DTR1) 16(DCD1) 17(RI1) 18(CTS0) 19(RTS0) 22(DSR0) 23(DTR0) 24(DCD0); U11 1(RI0) 9(RST) 10(CTS1) 11(RTS1) 14(DSR1) 15(DTR1) 16(DCD1) 17(RI1) 18(CTS0) 19(RTS0) 22(DSR0) 23(DTR0) 24(DCD0)

### Layout directives
differential pair: DD_n, DD_p, DDD_n, DDD_p

### Notes on the sheet
- UART1_TX
- UART1_RX
- UART2_TX
- UART2_RX

### Library data of the parts
C135 C136 C139 C140 = 0603 1uF (105) 10% 50V: 贴片电容; ComponentLink1Description: 供应商链接; ComponentLink1URL: http://www.szlcsc.com/product/details_16531.html; Package: 0603; Supplier: LC; SuppliersPartNumber: C15849
C137 C138 = 0402 100nF (104) 10% 16V: 贴片电容; ComponentLink1Description: 供应商链接; ComponentLink1URL: http://www.szlcsc.com/product/details_1877.html; Package: 0402; Supplier: LC; SuppliersPartNumber: C1525
D3 D4 = 0603 白灯: 发光二极管; ComponentLink1Description: 供应商链接; ComponentLink1URL: http://www.szlcsc.com/product/details_2663.html; Package: 0603; Supplier: LC; SuppliersPartNumber: C2290
J3 J4 = Type_C_16: USB type C 16pin
P4 = Header 6: Header, 6-Pin; LatestRevisionDate: 17-Jul-2002; LatestRevisionNote: Re-released for DXP Platform.; Publisher: Altium Limited
R92 R93 = 0402 5.1KΩ (5101) 1%: 贴片电阻; ComponentLink1Description: 供应商链接; ComponentLink1URL: http://www.szlcsc.com/product/details_26648.html; Package: 0402; Supplier: LC; SuppliersPartNumber: C25905
R94-R101 = 0805 0Ω (0R0) 1%: 贴片电阻; ComponentLink1Description: 供应商链接; ComponentLink1URL: http://www.szlcsc.com/product/details_18165.html; Package: 0805; Supplier: LC; SuppliersPartNumber: C17477
R102 R103 = 0402 330Ω (3300) 1%: 贴片电阻; ComponentLink1Description: 供应商链接; ComponentLink1URL: http://www.szlcsc.com/product/details_25847.html; Package: 0402; Supplier: LC; SuppliersPartNumber: C25104
U10 U11 = CH342F: USB to dual enhanced TTL Serial / 2*UART